# Altium project PV Refridgerator.PrjPCB (part 1 of 2)
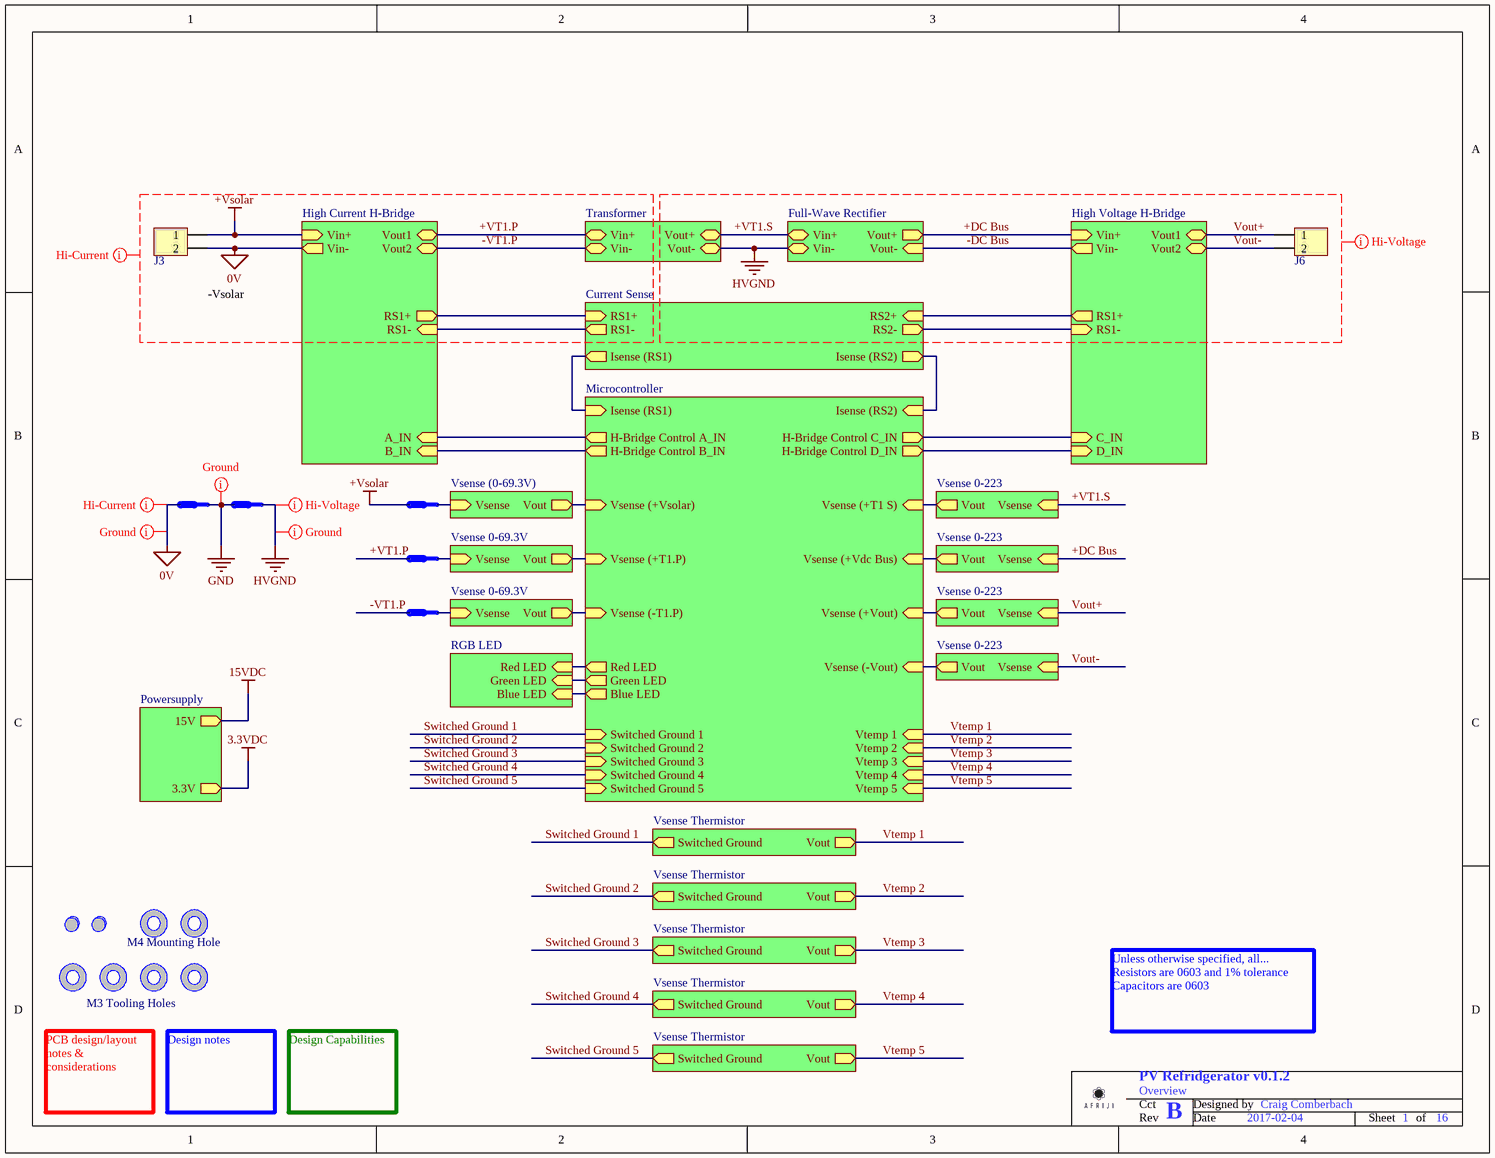
[diagram p0: Overview.SchDoc]
Designer: Craig Comberbach; ProjectRevision: v0.1.2; ProjectTitle: PV Refridgerator
9 sheets, 91 parts. Net scope: hierarchical (ports join the sheet entries above them; power ports are global).
Board file: PV Refridgerator v0.1.2.PCBDOC
Sheets:
  Overview.SchDoc
    High Current H-Bridge = High Current H-Bridge.SchDoc
      Half H-Bridge Driver = Half H-Bridge Driver.SchDoc
      Half H-Bridge Driver = Half H-Bridge Driver.SchDoc
    High Voltage H-Bridge = High Voltage H-Bridge.SchDoc
      Half H-Bridge Driver = Half H-Bridge Driver.SchDoc
      Half H-Bridge Driver = Half H-Bridge Driver.SchDoc
    Transformer = Transformer.SchDoc
    Microcontroller = Microcontroller.SchDoc
    Vsense 0-69.3V = Vsense 0-69.3V.SchDoc
    Vsense 0-223 = Vsense 0-223.3V.SchDoc
    Current Sense = Current Sense.SchDoc
    Vsense (0-69.3V) = Vsense 0-69.3V.SchDoc
    Vsense 0-69.3V = Vsense 0-69.3V.SchDoc
    Vsense 0-223 = Vsense 0-223.3V.SchDoc
    Vsense 0-223 = Vsense 0-223.3V.SchDoc
    Vsense 0-223 = Vsense 0-223.3V.SchDoc

## Sheet Overview.SchDoc: Overview
size Letter; Date: 2017-02-04; DocumentNumber: 1; Revision: B; SheetNumber: 1; SheetTotal: 16; DesignedBy: Craig Comberbach

### Parts
FID1  Fiducial, Double Sided  [Fiducial - Double sided]  (value not drawn)
FID3  Fiducial, Double Sided  [Fiducial - Double sided]  (value not drawn)
J3  Terminal Block - 2-Position HiV/HiA  [TE 796739-2]  (value not drawn)
J6  Terminal Block - 2-Position HiV/HiA  [TE 796739-2]  (value not drawn)
MountingHole1  M3 Tooling Holes  [M3 Screw - One Sided]  (no BOM)
MountingHole2  Mounting Hole  [M3 Screw - One Sided]  (value not drawn)  (no BOM)
MountingHole3  Mounting Hole  [M4 Screw - One Sided]  (value not drawn)  (no BOM)
MountingHole4  M4 Mounting Hole  [M4 Screw - One Sided]  (no BOM)
MountingHole5  Mounting Hole  [M3 Screw - One Sided]  (value not drawn)  (no BOM)
MountingHole6  Mounting Hole  [M3 Screw - One Sided]  (value not drawn)  (no BOM)
NetTie2  Net Tie  [Net tie (7/50 mil)]  (value not drawn)  (net tie, no BOM)
NetTie7  Net Tie  [Net tie (7/7 mil)]  (value not drawn)  (net tie, no BOM)
NetTie8  Net Tie  [Net tie (7/7 mil)]  (value not drawn)  (net tie, no BOM)
NetTie9  Net Tie  [Net tie (7/7 mil)]  (value not drawn)  (net tie, no BOM)
NetTie?  Net Tie  [Net tie (7/7 mil)]  (value not drawn)  (net tie, no BOM)

### Sub-sheets
Current Sense = Current Sense.SchDoc: RS1+ (in), RS1- (out), RS2+ (in), RS2- (out), Isense (RS1) (out), Isense (RS2) (out)
Full-Wave Rectifier = Full-Wave Rectifier.SchDoc (file not in this document): Vin+ (bidir), Vin- (bidir), Vout+ (out), Vout- (in)
High Current H-Bridge = High Current H-Bridge.SchDoc: Vout1 (bidir), Vout2 (bidir), Vin+ (in), Vin- (out), A_IN (in), B_IN (in), RS1+ (out), RS1- (in)
High Voltage H-Bridge = High Voltage H-Bridge.SchDoc: Vout1 (bidir), Vout2 (bidir), Vin+ (in), Vin- (out), C_IN (in), D_IN (in), RS1+ (out), RS1- (in)
Microcontroller = Microcontroller.SchDoc: H-Bridge Control A_IN (out), H-Bridge Control B_IN (out), H-Bridge Control C_IN (out), H-Bridge Control D_IN (out), Red LED (out), Green LED (out), Blue LED (out), Vsense (+T1.P) (in), Vsense (+Vsolar) (in), Vsense (-T1.P) (in), Vsense (+T1 S) (in), Vsense (+Vdc Bus) (in), Vsense (+Vout) (in), Vsense (-Vout) (in), Vtemp 1 (in), Vtemp 2 (in), Vtemp 3 (in), Vtemp 4 (in), Vtemp 5 (in), Isense (RS1) (in), Isense (RS2) (in), Switched Ground 1 (in), Switched Ground 2 (in), Switched Ground 3 (in), Switched Ground 4 (in), Switched Ground 5 (in)
Powersupply = Powersupply.SchDoc (file not in this document): 15V (out), 3.3V (out)
RGB LED = RGB LED.SchDoc (file not in this document): Red LED (in), Green LED (in), Blue LED (in)
Transformer = Transformer.SchDoc: Vin+ (bidir), Vin- (bidir), Vout+ (bidir), Vout- (bidir)
Vsense 0-69.3V = Vsense 0-69.3V.SchDoc: Vsense (in), Vout (out)
Vsense 0-69.3V = Vsense 0-69.3V.SchDoc: Vsense (in), Vout (out)
Vsense 0-223 = Vsense 0-223.3V.SchDoc: Vsense (in), Vout (out)
Vsense 0-223 = Vsense 0-223.3V.SchDoc: Vsense (in), Vout (out)
Vsense 0-223 = Vsense 0-223.3V.SchDoc: Vsense (in), Vout (out)
Vsense 0-223 = Vsense 0-223.3V.SchDoc: Vsense (in), Vout (out)
Vsense (0-69.3V) = Vsense 0-69.3V.SchDoc: Vsense (in), Vout (out)
Vsense Thermistor = Vsense Thermistor.SchDoc (file not in this document): Switched Ground (out), Vout (out)
Vsense Thermistor = Vsense Thermistor.SchDoc (file not in this document): Switched Ground (out), Vout (out)
Vsense Thermistor = Vsense Thermistor.SchDoc (file not in this document): Switched Ground (out), Vout (out)
Vsense Thermistor = Vsense Thermistor.SchDoc (file not in this document): Switched Ground (out), Vout (out)
Vsense Thermistor = Vsense Thermistor.SchDoc (file not in this document): Switched Ground (out), Vout (out)

### Nets
0V: J3.2 NetTie2.2 ; sheet High Current H-Bridge/Vin-, sheet High Current H-Bridge/RS1-, sheet Current Sense/RS1-
+Vsolar: J3.1 NetTie7.2 ; sheet High Current H-Bridge/Vin+
GND: NetTie2.1 NetTie?.2
HVGND: NetTie?.1 ; sheet Full-Wave Rectifier/Vin-, sheet Transformer/Vout-
+DC Bus: sheet Full-Wave Rectifier/Vout+, sheet High Voltage H-Bridge/Vin+, sheet Vsense 0-223/Vsense
+VT1.P: NetTie8.2 ; sheet High Current H-Bridge/Vout1, sheet Transformer/Vin+
+VT1.S: sheet Full-Wave Rectifier/Vin+, sheet Transformer/Vout+, sheet Vsense 0-223/Vsense
-DC Bus: sheet Full-Wave Rectifier/Vout-, sheet High Voltage H-Bridge/Vin-, sheet High Voltage H-Bridge/RS1-, sheet Current Sense/RS2-
-VT1.P: NetTie9.2 ; sheet High Current H-Bridge/Vout2, sheet Transformer/Vin-
Isense (RS1): sheet Microcontroller/Isense (RS1), sheet Current Sense/Isense (RS1)
Isense (RS2): sheet Microcontroller/Isense (RS2), sheet Current Sense/Isense (RS2)
LOA HiA: sheet High Current H-Bridge/A_IN, sheet Microcontroller/H-Bridge Control A_IN
LOA HiV: sheet High Voltage H-Bridge/D_IN, sheet Microcontroller/H-Bridge Control D_IN
LOB HiA: sheet High Current H-Bridge/B_IN, sheet Microcontroller/H-Bridge Control B_IN
LOB HiV: sheet High Voltage H-Bridge/C_IN, sheet Microcontroller/H-Bridge Control C_IN
Switched Ground 1: sheet Microcontroller/Switched Ground 1, sheet Vsense Thermistor/Switched Ground
Switched Ground 2: sheet Microcontroller/Switched Ground 2, sheet Vsense Thermistor/Switched Ground
Switched Ground 3: sheet Microcontroller/Switched Ground 3, sheet Vsense Thermistor/Switched Ground
Switched Ground 4: sheet Microcontroller/Switched Ground 4, sheet Vsense Thermistor/Switched Ground
Switched Ground 5: sheet Microcontroller/Switched Ground 5, sheet Vsense Thermistor/Switched Ground
Vout+: J6.1 ; sheet High Voltage H-Bridge/Vout1, sheet Vsense 0-223/Vsense  [project net C_VS]
Vout-: J6.2 ; sheet High Voltage H-Bridge/Vout2, sheet Vsense 0-223/Vsense  [project net D_VS]
Vsense (+T1 S): sheet Microcontroller/Vsense (+T1 S), sheet Vsense 0-223/Vout
Vsense (+T1.P): sheet Microcontroller/Vsense (+T1.P), sheet Vsense 0-69.3V/Vout
Vsense (+Vdc Bus): sheet Microcontroller/Vsense (+Vdc Bus), sheet Vsense 0-223/Vout
Vsense (+Vout): sheet Microcontroller/Vsense (+Vout), sheet Vsense 0-223/Vout
Vsense (+Vsolar): sheet Microcontroller/Vsense (+Vsolar), sheet Vsense (0-69.3V)/Vout
Vsense (-T1.P): sheet Microcontroller/Vsense (-T1.P), sheet Vsense 0-69.3V/Vout
Vsense (-Vout): sheet Microcontroller/Vsense (-Vout), sheet Vsense 0-223/Vout
Vtemp 1: sheet Microcontroller/Vtemp 1, sheet Vsense Thermistor/Vout
Vtemp 2: sheet Microcontroller/Vtemp 2, sheet Vsense Thermistor/Vout
Vtemp 3: sheet Microcontroller/Vtemp 3, sheet Vsense Thermistor/Vout
Vtemp 4: sheet Microcontroller/Vtemp 4, sheet Vsense Thermistor/Vout
Vtemp 5: sheet Microcontroller/Vtemp 5, sheet Vsense Thermistor/Vout
NetNetTie3_2: sheet High Current H-Bridge/RS1+, sheet Current Sense/RS1+
NetNetTie5_2: sheet High Voltage H-Bridge/RS1+, sheet Current Sense/RS2+
NetNetTie7_1: NetTie7.1 ; sheet Vsense (0-69.3V)/Vsense
NetNetTie8_1: NetTie8.1 ; sheet Vsense 0-69.3V/Vsense
NetNetTie9_1: NetTie9.1 ; sheet Vsense 0-69.3V/Vsense
NetU1_43: sheet Microcontroller/Red LED, sheet RGB LED/Red LED
NetU1_44: sheet Microcontroller/Green LED, sheet RGB LED/Green LED
NetU1_45: sheet Microcontroller/Blue LED, sheet RGB LED/Blue LED

### Layout directives
net class 15A: 0V, +Vsolar, +VT1.P, -VT1.P
net class 171-250V: +DC Bus, +VT1.S, -DC Bus, HVGND, Vout+, Vout-
net class Grounds: 0V, GND, HVGND

### Notes on the sheet
- (near J3) -Vsolar
- Unless otherwise specified, all...
  Resistors are 0603 and 1% tolerance
  Capacitors are 0603
- PCB design/layout notes & considerations
- Design notes
- Design Capabilities
- Cct
- Designed by
- Rev
- Date
- Sheet
- of

### Library data of the parts
J3 J6 = Terminal Block - 2-Position HiV/HiA: Manufacturer: TE Connectivity AMP Connectors; Manufacturer Part Number: 796739-2; Number of Levels: 1; Positions Per Level: 2; Pitch: 0.375" (9.53mm); Mating Orientation: Horizontal with Board; Current: 30A; Voltage: 600V; Wire Gauge: 10-30 AWG; Wire Termination: Screw - Rising Cage Clamp; Clamp Material - Plating: Brass - Nickel Plated; Torque - Screw: 0.79 Nm (7.0 Lb-In); Screw Thread: M3; Supplier 1: Digi-Key; RoHS: RoHS Compliant; Category: Connectors, Interconnects; Stock 1: 14124; Pricing 1: 1=2.21, 10=1.673, 25=1.5504, 50=1.394, 100=1.36, 250=1.19, 500=1.088, 1000=0.986, 2500=0.884 (USD); Packaging: Tray; Part Status: Active; Mounting Type: Through Hole; Features: Interlocking (Side); Color: Green; Operating Temperature: -; Housing Material: Polyamide (PA66), Nylon 6/6; Contact Material - Plating: -; Screw Material - Plating: Brass - Nickel Plated; ComponentLink1URL: http://www.te.com/commerce/DocumentDelivery/DDEController?Action=srchrtrv&DocNm=796739&DocType=Customer+Drawing&DocLang=English; ComponentLink1Description: Spec Sheet; Supplier Part Number 1: A98273-ND
MountingHole1 MountingHole4 = Mounting Hole
NetTie2 NetTie7-NetTie9 NetTie? = Net Tie: Ties two nets together
FID1 FID3 = Fiducial, Double Sided: Technology: Mechanical

## Sheet High Current H-Bridge.SchDoc: High Current H-Bridge
size Letter; Date: 2017-01-26; DocumentNumber: 2; Revision: A; SheetNumber: 2; SheetTotal: 16; DesignedBy: Mike MacKay
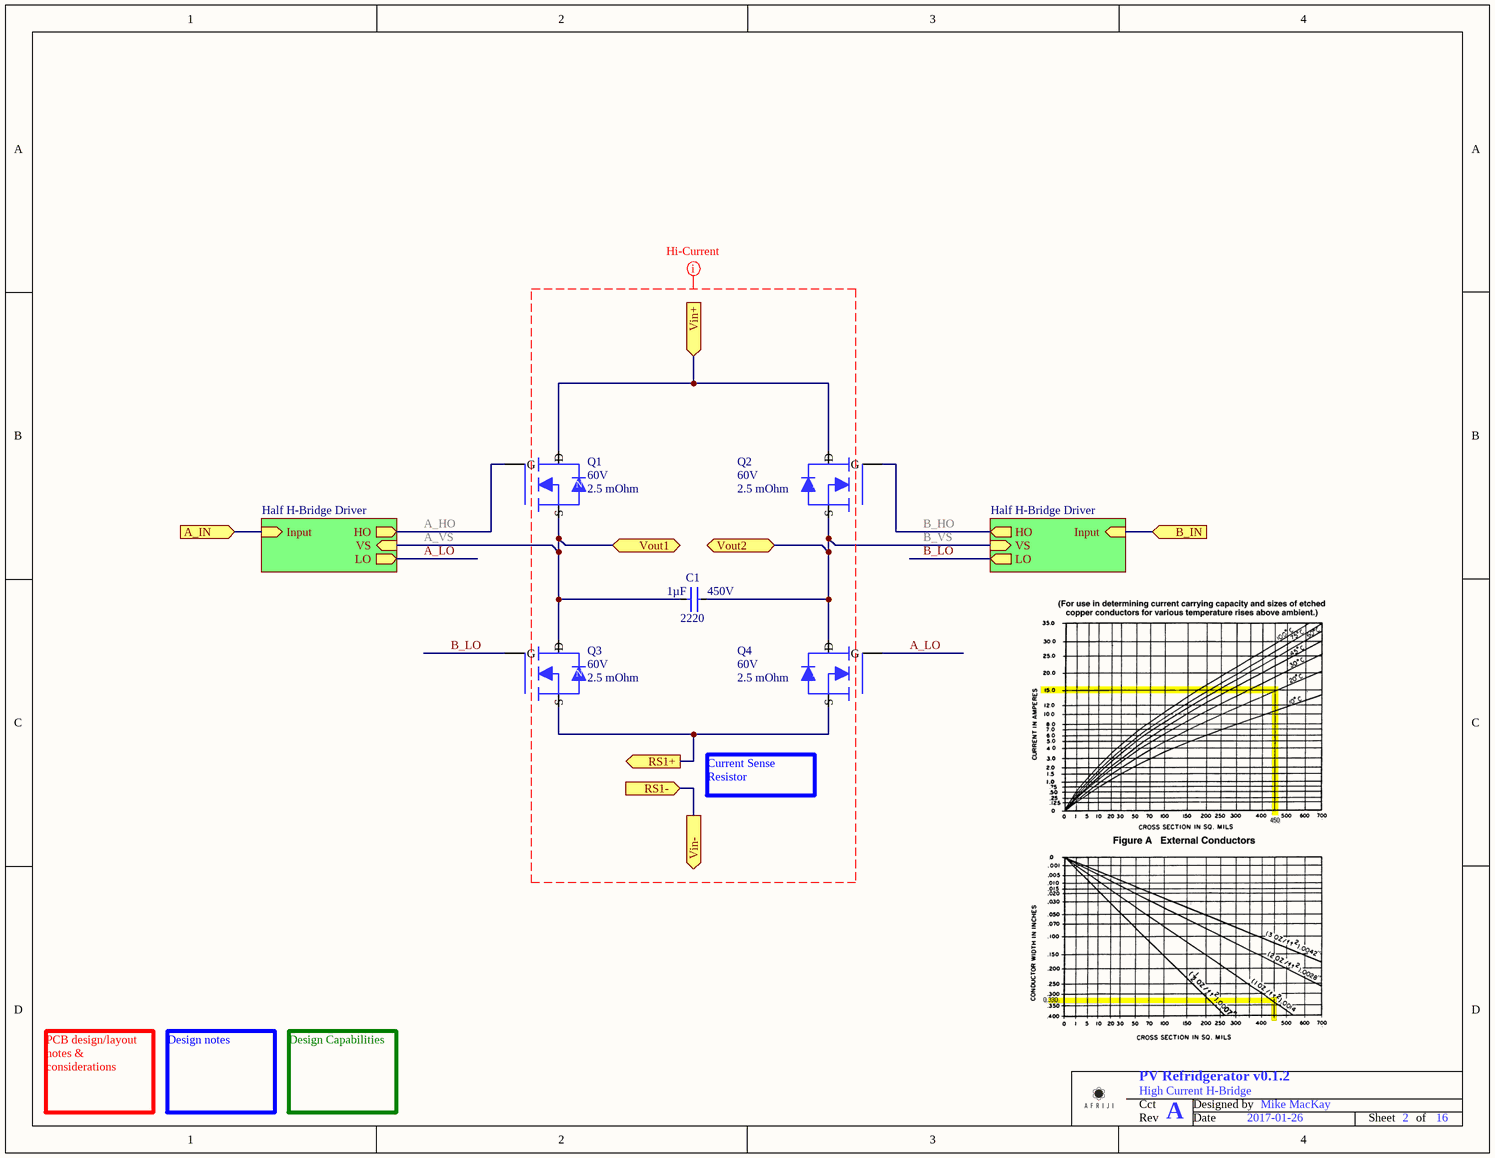
[diagram p1: High Current H-Bridge.SchDoc]

### Parts
C1  Capacitance: 1µF  Voltage - Rated: 450V  Package / Case: 2220  [C2220 - Ceramic]  (hidden comment: 1uF 2220 450V)
Q1  Drain to Source Voltage (Vdss): 60V  Rds On (Max) @ Id, Vgs: 2.5 mOhm  [DPAK]  (hidden comment: N-MOSFET)
Q2  Drain to Source Voltage (Vdss): 60V  Rds On (Max) @ Id, Vgs: 2.5 mOhm  [DPAK]  (hidden comment: N-MOSFET)
Q3  Drain to Source Voltage (Vdss): 60V  Rds On (Max) @ Id, Vgs: 2.5 mOhm  [DPAK]  (hidden comment: N-MOSFET)
Q4  Drain to Source Voltage (Vdss): 60V  Rds On (Max) @ Id, Vgs: 2.5 mOhm  [DPAK]  (hidden comment: N-MOSFET)

### Sub-sheets
Half H-Bridge Driver = Half H-Bridge Driver.SchDoc: HO (out), VS (in), LO (out), Input (in)
Half H-Bridge Driver = Half H-Bridge Driver.SchDoc: HO (out), VS (in), LO (out), Input (in)

### Ports
A_IN (in), B_IN (in), RS1+ (out), RS1- (in), Vin+ (in), Vin- (out), Vout1 (bidir), Vout2 (bidir)

### Nets
0V: port Vin-, port RS1-
+Vsolar: Q1.2(D) Q2.2(D) ; port Vin+
A_HO: Q1.1(G) ; sheet Half H-Bridge Driver/HO
A_LO: Q4.1(G) ; sheet Half H-Bridge Driver/LO
A_VS: C1.1 Q1.3(S) Q3.2(D) ; port Vout1, sheet Half H-Bridge Driver/VS  [project net +VT1.P]
B_HO: Q2.1(G) ; sheet Half H-Bridge Driver/HO
B_LO: Q3.1(G) ; sheet Half H-Bridge Driver/LO
B_VS: C1.2 Q2.3(S) Q4.2(D) ; port Vout2, sheet Half H-Bridge Driver/VS  [project net -VT1.P]
LOA HiA: port A_IN, sheet Half H-Bridge Driver/Input
LOB HiA: port B_IN, sheet Half H-Bridge Driver/Input
NetNetTie3_2: Q3.3(S) Q4.3(S) ; port RS1+

### Layout directives
net class 15A: (no net found under the mark)

### Notes on the sheet
- Current Sense Resistor
- PCB design/layout notes & considerations
- Design notes
- Design Capabilities
- Cct
- Designed by
- Rev
- Date
- Sheet
- of
- (in symbol N-MOSFET 2.5mR 60V) N

### Library data of the parts
C1 = 1uF 2220 450V: Manufacturer: TDK Corporation; Manufacturer Part Number: CGA9P4X7T2W105M250KE; Tolerance: ±20%; Temperature Coefficient: X7T; Supplier 1: Digi-Key; Supplier Part Number 1: 445-7998-1-ND; RoHS: RoHS Compliant; Category: Capacitors; Stock 1: 10247; Pricing 1: 1=3.11, 10=2.576, 100=2.1589, 250=1.78012 (USD); Packaging: Cut Tape (CT); Part Status: Active; Operating Temperature: -55°C ~ 125°C; Features: Soft Termination; Ratings: AEC-Q200; Applications: Automotive, Boardflex Sensitive; Failure Rate: -; Mounting Type: Surface Mount, MLCC; Size / Dimension: 0.224" L x 0.197" W (5.70mm x 5.00mm); Height - Seated (Max): -; Thickness (Max): 0.098" (2.50mm); Lead Spacing: -; Lead Style: -; ComponentLink1URL: https://product.tdk.com/info/en/catalog/datasheets/mlcc_automotive_soft_en.pdf; ComponentLink1Description: Spec Sheet; Value: 1uF 2220 450V
Q1-Q4 = N-MOSFET 2.5mR 60V: Manufacturer: Infineon Technologies; Manufacturer Part Number: IPD025N06N; FET Type: N-Channel; Current - Continuous Drain (Id) @ 25°C: 90A; Drive Voltage (Max Rds On,  Min Rds On): 6V, 10V; Vgs(th) (Max) @ Id: 2.8V @ 95µA; Gate Charge (Qg) (Max) @ Vgs: 71nC @ 10V; Input Capacitance (Ciss) (Max) @ Vds: 5200pF @ 30V; Vgs (Max): ±20V; Power Dissipation (Max): 3W (Ta), 167W (Tc); Supplier 1: Digi-Key; Supplier Part Number 1: IPD025N06NCT-ND; RoHS: RoHS Compliant; Category: Discrete Semiconductor Products; Stock 1: 5405; Pricing 1: 1=1.91, 10=1.72, 100=1.3822, 500=1.13558, 1000=0.94091 (USD); Packaging: Cut Tape (CT); Part Status: Active; Technology: MOSFET (Metal Oxide); FET Feature: -; Operating Temperature: -55°C ~ 175°C (TJ); Mounting Type: Surface Mount; Supplier Device Package: PG-TO252-3; Package / Case: TO-252-3, DPak (2 Leads + Tab), SC-63; ComponentLink1URL: http://www.infineon.com/dgdl/IPD025N06N_Rev2+1.pdf?folderId=db3a304313b8b5a60113cee8763b02d7&fileId=db3a304336415dec0136531648062c76; ComponentLink1Description: Spec Sheet; Value: N-MOSFET 2.5mR

## Sheet Half H-Bridge Driver.SchDoc: N-FET Driver
size Letter; Date: 2017-02-04; DocumentNumber: 3; Revision: A; SheetNumber: 3; SheetTotal: 16; DesignedBy: Mike MacKay
Used 4 times, as channels High Current H-Bridge/Half H-Bridge Driver, High Current H-Bridge/Half H-Bridge Driver, High Voltage H-Bridge/Half H-Bridge Driver, High Voltage H-Bridge/Half H-Bridge Driver. Parts and nets are listed once, with the designators drawn on the sheet.
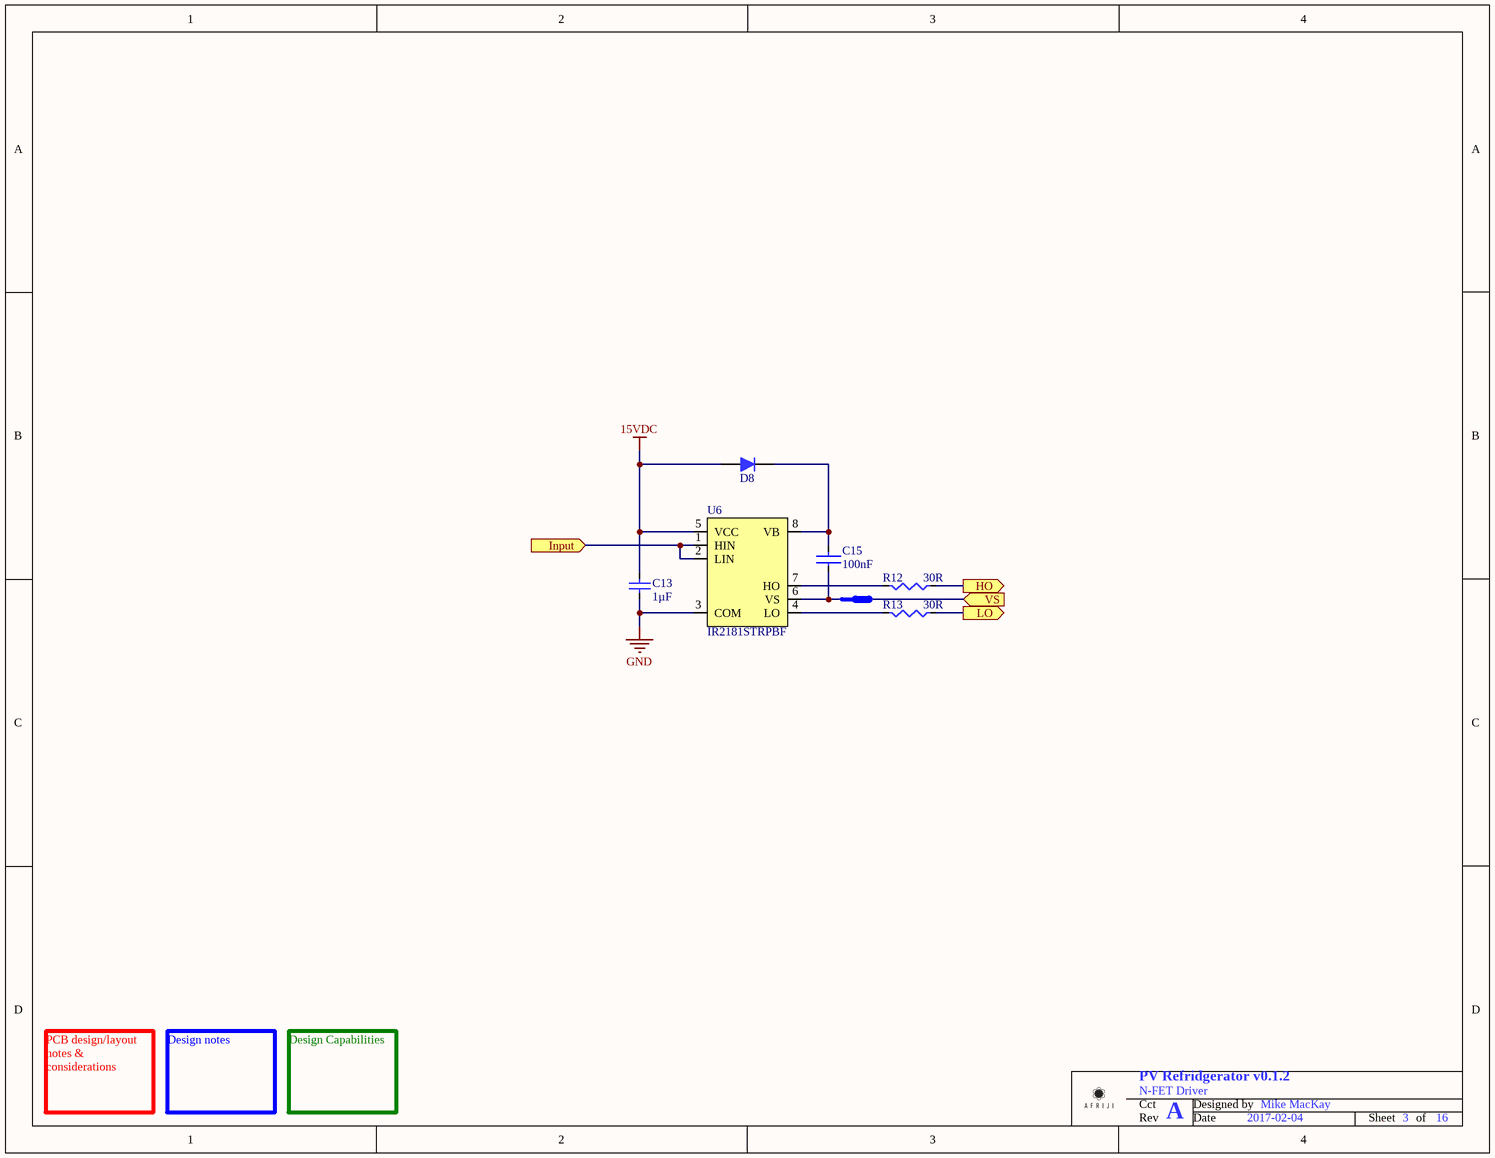
[diagram p2: Half H-Bridge Driver.SchDoc]

### Parts
C13  Capacitance: 1µF  [Capacitor - 0603 Ceramic]  (hidden comment: 1uF 0603 25V)
C15  Capacitance: 100nF  [C0603 - Ceramic]  (hidden comment: 100nF 0603 50V)
D8  (no value)  [SMA - Diode]
NetTie1  Net Tie  [Net tie (7/7 mil)]  (value not drawn)  (net tie, no BOM)
R12  Resistance (Ohms): 30R  [R0603]  (hidden comment: Template - Resistor)
R13  Resistance (Ohms): 30R  [R0603]  (hidden comment: Template - Resistor)
U6  Manufacturer Part Number: IR2181STRPBF  [SOIC-8]  (hidden comment: H-Bridge Driver)

### Ports
HO (out), Input (in), LO (out), VS (in)

### Nets
15VDC: C13.1 D8.1(Anode) U6.5(VCC)
GND: C13.2 U6.3(COM)
HO: R12.2 ; port HO
Input: U6.1(HIN) U6.2(LIN) ; port Input
LO: R13.2 ; port LO
VS: NetTie1.2 ; port VS
NetC15_1: C15.1 D8.2(Cathode) U6.8(VB)
NetC15_2: C15.2 NetTie1.1 U6.6(VS)
NetR12_1: R12.1 U6.7(HO)
NetR13_1: R13.1 U6.4(LO)

### Channels
High Current H-Bridge/Half H-Bridge Driver: designators end in A; ports HO=A_HO Input=LOA HiA LO=A_LO VS=+VT1.P
High Current H-Bridge/Half H-Bridge Driver: designators end in B; ports HO=B_HO Input=LOB HiA LO=B_LO VS=-VT1.P
High Voltage H-Bridge/Half H-Bridge Driver: designators end in C; ports HO=C_HO Input=LOB HiV LO=C_LO VS=C_VS
High Voltage H-Bridge/Half H-Bridge Driver: designators end in D; ports HO=D_HO Input=LOA HiV LO=D_LO VS=D_VS

### Notes on the sheet
- PCB design/layout notes & considerations
- Design notes
- Design Capabilities
- Cct
- Designed by
- Rev
- Date
- Sheet
- of

### Library data of the parts
C13 = 1uF 0603 25V: Non-polarized; Manufacturer: Murata Electronics North America; Manufacturer Part Number: GRM188R61E105KA12D; Value: 1uF 0603 16V; Tolerance: ±10%; Temperature Coefficient: X5R; Technology: SMT; Supplier 1: Digi-Key; RoHS: RoHS Compliant; Category: Capacitors; Stock 1: 1582906; Pricing 1: 1=0.14, 10=0.059, 50=0.0322, 100=0.0273, 250=0.02232, 500=0.01908, 1000=0.01488 (CAD); Packaging: Cut Tape (CT); Voltage - Rated: 25V; Mounting Type: Surface Mount, MLCC; Operating Temperature: -55°C ~ 85°C; Applications: General Purpose; Ratings: -; Package / Case: 0603 (1608 Metric); Size / Dimension: 0.063" L x 0.031" W (1.60mm x 0.80mm); Height - Seated (Max): -; Thickness (Max): 0.035" (0.90mm); Lead Spacing: -; Features: -; Lead Style: -; ComponentLink1URL: http://www.murata.com/~/media/webrenewal/support/library/catalog/products/capacitor/mlcc/c02e.ashx; ComponentLink1Description: Spec Sheet; Supplier Part Number 1: 490-3897-1-ND
C15 = 100nF 0603 50V: Manufacturer: Samsung Electro-Mechanics America, Inc; Manufacturer Part Number: CL10B104KB8SFNC; Tolerance: ±10%; Temperature Coefficient: X7R; Value: 100nF 0603 50V; Supplier 1: Digi-Key; RoHS: RoHS Compliant; Category: Capacitors; Stock 1: 1192070; Pricing 1: 1=0.1, 10=0.027, 25=0.0192, 100=0.0125, 500=0.00874, 1000=0.00681 (USD); Packaging: Cut Tape (CT); Voltage - Rated: 50V; Mounting Type: Surface Mount, MLCC; Operating Temperature: -55°C ~ 125°C; Applications: Boardflex Sensitive; Ratings: -; Package / Case: 0603 (1608 Metric); Size / Dimension: 0.063" L x 0.031" W (1.60mm x 0.80mm); Height - Seated (Max): -; Thickness (Max): 0.035" (0.90mm); Lead Spacing: -; Features: Soft Termination; Lead Style: -; ComponentLink1URL: http://www.samsungsem.com/kr/front/downloadcms.do?path=/kr/support/product-search/mlcc/__icsFiles/afieldfile/2014/11/05&fileName=S_CL10B104KB8SFNC.pdf; ComponentLink1Description: http://www.samsungsem.com/kr/front/downloadcms.do?path=/kr/support/product-search/mlcc/__icsFiles/afieldfile/2014/11/05&fileName=S_CL10B104KB8SFNC.pdf; Supplier Part Number 1: 1276-1936-1-ND
D8 = Diode - Signal 1A: Signal Diode; Manufacturer: Vishay Semiconductor Diodes Division; Manufacturer Part Number: US1G-E3/5AT; Diode Type: Standard; Voltage - DC Reverse (Vr) (Max): 400V; Current - Average Rectified (Io): 1A; Voltage - Forward (Vf) (Max) @ If: 1V @ 1A; Speed: Fast Recovery =< 500ns, > 200mA (Io); Reverse Recovery Time (trr): 50ns; Current - Reverse Leakage @ Vr: 10µA @ 400V; Capacitance @ Vr, F: 15pF @ 4V, 1MHz; Supplier 1: Digi-Key; Supplier Part Number 1: US1G-E3/5ATGICT-ND; RoHS: RoHS Compliant; Category: Discrete Semiconductor Products; Stock 1: 29002; Pricing 1: 1=0.41, 10=0.312, 25=0.2816, 100=0.1945, 250=0.1638, 500=0.1331, 1000=0.10238, 2500=0.09214 (USD); Packaging: Cut Tape (CT); Part Status: Active; Mounting Type: Surface Mount; Package / Case: DO-214AC, SMA; Supplier Device Package: DO-214AC (SMA); Operating Temperature - Junction: -55°C ~ 150°C; ComponentLink1URL: http://www.vishay.com/docs/88768/us1.pdf; ComponentLink1Description: Spec Sheet
NetTie1 = Net Tie: Ties two nets together
R12 R13 = Template - Resistor: Manufacturer: Yageo; Manufacturer Part Number: RC0603FR-0730RL; Tolerance: ±1%; Power (Watts): 0.1W, 1/10W; Temperature Coefficient: ±100ppm/°C; Supplier 1: Digi-Key; Supplier Part Number 1: 311-30.0HRCT-ND; RoHS: RoHS Compliant; Category: Resistors; Stock 1: 158658; Pricing 1: 1=0.1, 10=0.013, 25=0.0092, 50=0.007, 100=0.0052, 250=0.00396, 500=0.00316, 1000=0.00233 (USD); Packaging: Cut Tape (CT); Part Status: Active; Composition: Thick Film; Features: Moisture Resistant; Operating Temperature: -55°C ~ 155°C; Package / Case: 0603 (1608 Metric); Supplier Device Package: 0603; Size / Dimension: 0.063" L x 0.031" W (1.60mm x 0.80mm); Height - Seated (Max): 0.022" (0.55mm); Number of Terminations: 2; Failure Rate: -; ComponentLink1URL: http://www.yageo.com/NewPortal/yageodocoutput?fileName=/pdf/R-Chip/PYu-RC_Group_51_RoHS_L_4.pdf; ComponentLink1Description: Spec Sheet
U6 = H-Bridge Driver: Manufacturer: Infineon Technologies; Driven Configuration: Half-Bridge; Channel Type: Independent; Gate Type: IGBT, N-Channel MOSFET; Voltage - Supply: 10 V ~ 20 V; Logic Voltage - VIL, VIH: 0.8V, 2.7V; Current - Peak Output (Source, Sink): 1.9A, 2.3A; Input Type: Non-Inverting; High Side Voltage - Max (Bootstrap): 600V; Rise / Fall Time (Typ): 40ns, 20ns; Supplier 1: Digi-Key; RoHS: RoHS Compliant; Category: Integrated Circuits (ICs); Stock 1: 2915; Pricing 1: 1=3.06, 10=2.75, 100=2.2535, 500=1.9184, 1000=1.61792 (USD); Packaging: Cut Tape (CT); Part Status: Active; Operating Temperature: -40°C ~ 150°C (TJ); Mounting Type: Surface Mount; Package / Case: 8-SOIC (0.154", 3.90mm Width); Supplier Device Package: 8-SOIC; ComponentLink1URL: http://www.irf.com/product-info/datasheets/data/ir2181.pdf; ComponentLink1Description: Spec Sheet; Supplier Part Number 1: IR2181SPBFCT-ND

## Sheet High Voltage H-Bridge.SchDoc: High Voltage H-Bridge
size Letter; Date: 2017-01-26; DocumentNumber: 7; Revision: A; SheetNumber: 7; SheetTotal: 16; DesignedBy: Mike MacKay
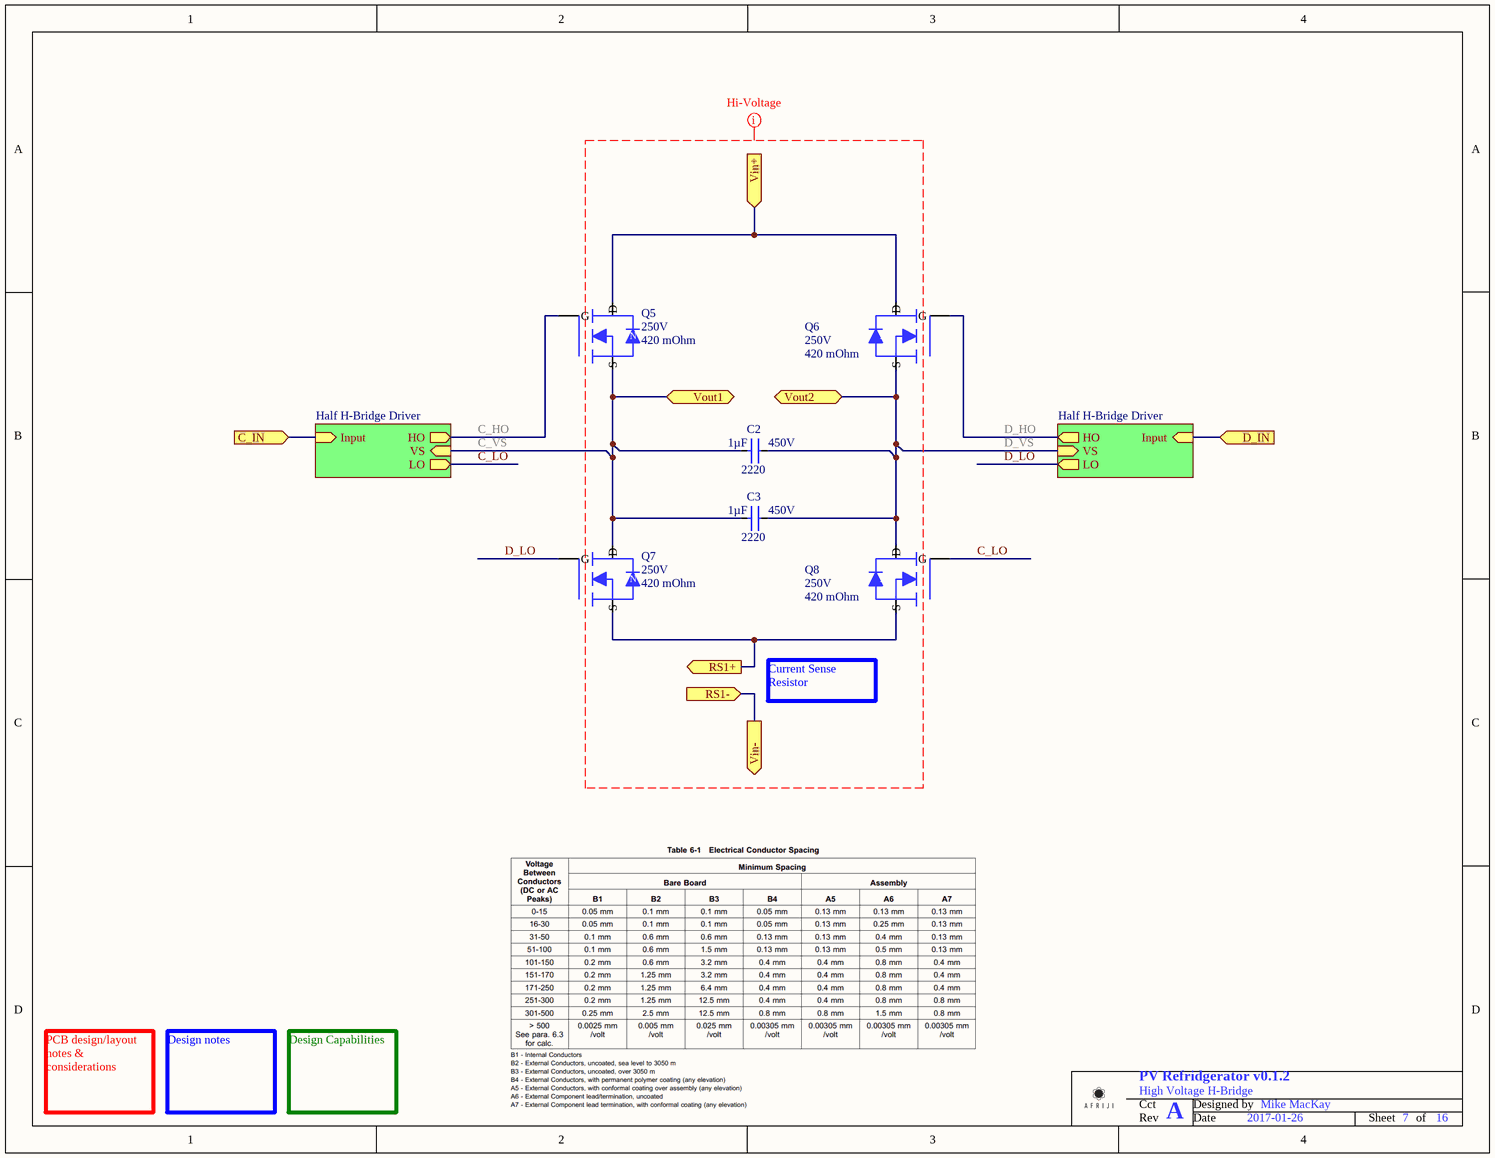
[diagram p3: High Voltage H-Bridge.SchDoc]

### Parts
C2  Capacitance: 1µF  Voltage - Rated: 450V  Package / Case: 2220  [C2220 - Ceramic]  (hidden comment: 1uF 2220 450V)
C3  Capacitance: 1µF  Voltage - Rated: 450V  Package / Case: 2220  [C2220 - Ceramic]  (hidden comment: 1uF 2220 450V)
Q5  Drain to Source Voltage (Vdss): 250V  Rds On (Max) @ Id, Vgs: 420 mOhm  [DPAK]  (hidden comment: N-MOSFET 420mR 250V)
Q6  Drain to Source Voltage (Vdss): 250V  Rds On (Max) @ Id, Vgs: 420 mOhm  [DPAK]  (hidden comment: N-MOSFET 420mR 250V)
Q7  Drain to Source Voltage (Vdss): 250V  Rds On (Max) @ Id, Vgs: 420 mOhm  [DPAK]  (hidden comment: N-MOSFET 420mR 250V)
Q8  Drain to Source Voltage (Vdss): 250V  Rds On (Max) @ Id, Vgs: 420 mOhm  [DPAK]  (hidden comment: N-MOSFET 420mR 250V)

### Sub-sheets
Half H-Bridge Driver = Half H-Bridge Driver.SchDoc: HO (out), VS (in), LO (out), Input (in)
Half H-Bridge Driver = Half H-Bridge Driver.SchDoc: HO (out), VS (in), LO (out), Input (in)

### Ports
C_IN (in), D_IN (in), RS1+ (out), RS1- (in), Vin+ (in), Vin- (out), Vout1 (bidir), Vout2 (bidir)

### Nets
+DC Bus: Q5.2(D) Q6.2(D) ; port Vin+
-DC Bus: port Vin-, port RS1-
C_HO: Q5.1(G) ; sheet Half H-Bridge Driver/HO
C_LO: Q8.1(G) ; sheet Half H-Bridge Driver/LO
C_VS: C2.1 C3.1 Q5.3(S) Q7.2(D) ; port Vout1, sheet Half H-Bridge Driver/VS
D_HO: Q6.1(G) ; sheet Half H-Bridge Driver/HO
D_LO: Q7.1(G) ; sheet Half H-Bridge Driver/LO
D_VS: C2.2 C3.2 Q6.3(S) Q8.2(D) ; port Vout2, sheet Half H-Bridge Driver/VS
LOA HiV: port D_IN, sheet Half H-Bridge Driver/Input
LOB HiV: port C_IN, sheet Half H-Bridge Driver/Input
NetNetTie5_2: Q7.3(S) Q8.3(S) ; port RS1+

### Layout directives
net class 171-250V: (no net found under the mark)

### Notes on the sheet
- Current Sense Resistor
- PCB design/layout notes & considerations
- Design notes
- Design Capabilities
- Cct
- Designed by
- Rev
- Date
- Sheet
- of
- (in symbol N-MOSFET 420mR 250V) N

### Library data of the parts
C2 C3 = 1uF 2220 450V: as C1 on sheet High Current H-Bridge; Supplier 1: Digi-Key; Supplier Part Number 1: 445-7998-1-ND; RoHS: RoHS Compliant; Category: Capacitors; Stock 1: 10247; Pricing 1: 1=3.11, 10=2.576, 100=2.1589, 250=1.78012 (USD); Packaging: Cut Tape (CT); Part Status: Active; Operating Temperature: -55°C ~ 125°C; Features: Soft Termination; Ratings: AEC-Q200; Applications: Automotive, Boardflex Sensitive; Failure Rate: -; Mounting Type: Surface Mount, MLCC; Size / Dimension: 0.224" L x 0.197" W (5.70mm x 5.00mm); Height - Seated (Max): -; Thickness (Max): 0.098" (2.50mm); Lead Spacing: -; Lead Style: -; ComponentLink1URL: https://product.tdk.com/info/en/catalog/datasheets/mlcc_automotive_soft_en.pdf; ComponentLink1Description: Spec Sheet; Value: 1uF 2220 450V
Q5-Q8 = N-MOSFET 420mR 250V: Manufacturer: Fairchild/ON Semiconductor; Manufacturer Part Number: FQD9N25TM; FET Type: N-Channel; Current - Continuous Drain (Id) @ 25°C: 7.4A (Tc); Drive Voltage (Max Rds On,  Min Rds On): 10V; Vgs(th) (Max) @ Id: 5V @ 250µA; Gate Charge (Qg) (Max) @ Vgs: 20nC @ 10V; Input Capacitance (Ciss) (Max) @ Vds: 700pF @ 25V; Vgs (Max): ±30V; Power Dissipation (Max): 2.5W (Ta), 55W (Tc); Supplier 1: Digi-Key; Supplier Part Number 1: FQD9N25TMCT-ND; RoHS: RoHS Compliant; Category: Discrete Semiconductor Products; Stock 1: 4941; Pricing 1: 1=0.86, 10=0.766, 100=0.597, 500=0.49316, 1000=0.38934 (USD); Packaging: Cut Tape (CT); Part Status: Active; Technology: MOSFET (Metal Oxide); FET Feature: -; Operating Temperature: -55°C ~ 150°C (TJ); Mounting Type: Surface Mount; Supplier Device Package: D-Pak; Package / Case: TO-252-3, DPak (2 Leads + Tab), SC-63; ComponentLink1URL: https://www.fairchildsemi.com/datasheets/FQ/FQD9N25.pdf; ComponentLink1Description: Spec Sheet

## Sheet Transformer.SchDoc: Transformer
size Letter; Date: 2017-01-26; DocumentNumber: 5; Revision: A; SheetNumber: 5; SheetTotal: 16; DesignedBy: Mike MacKay
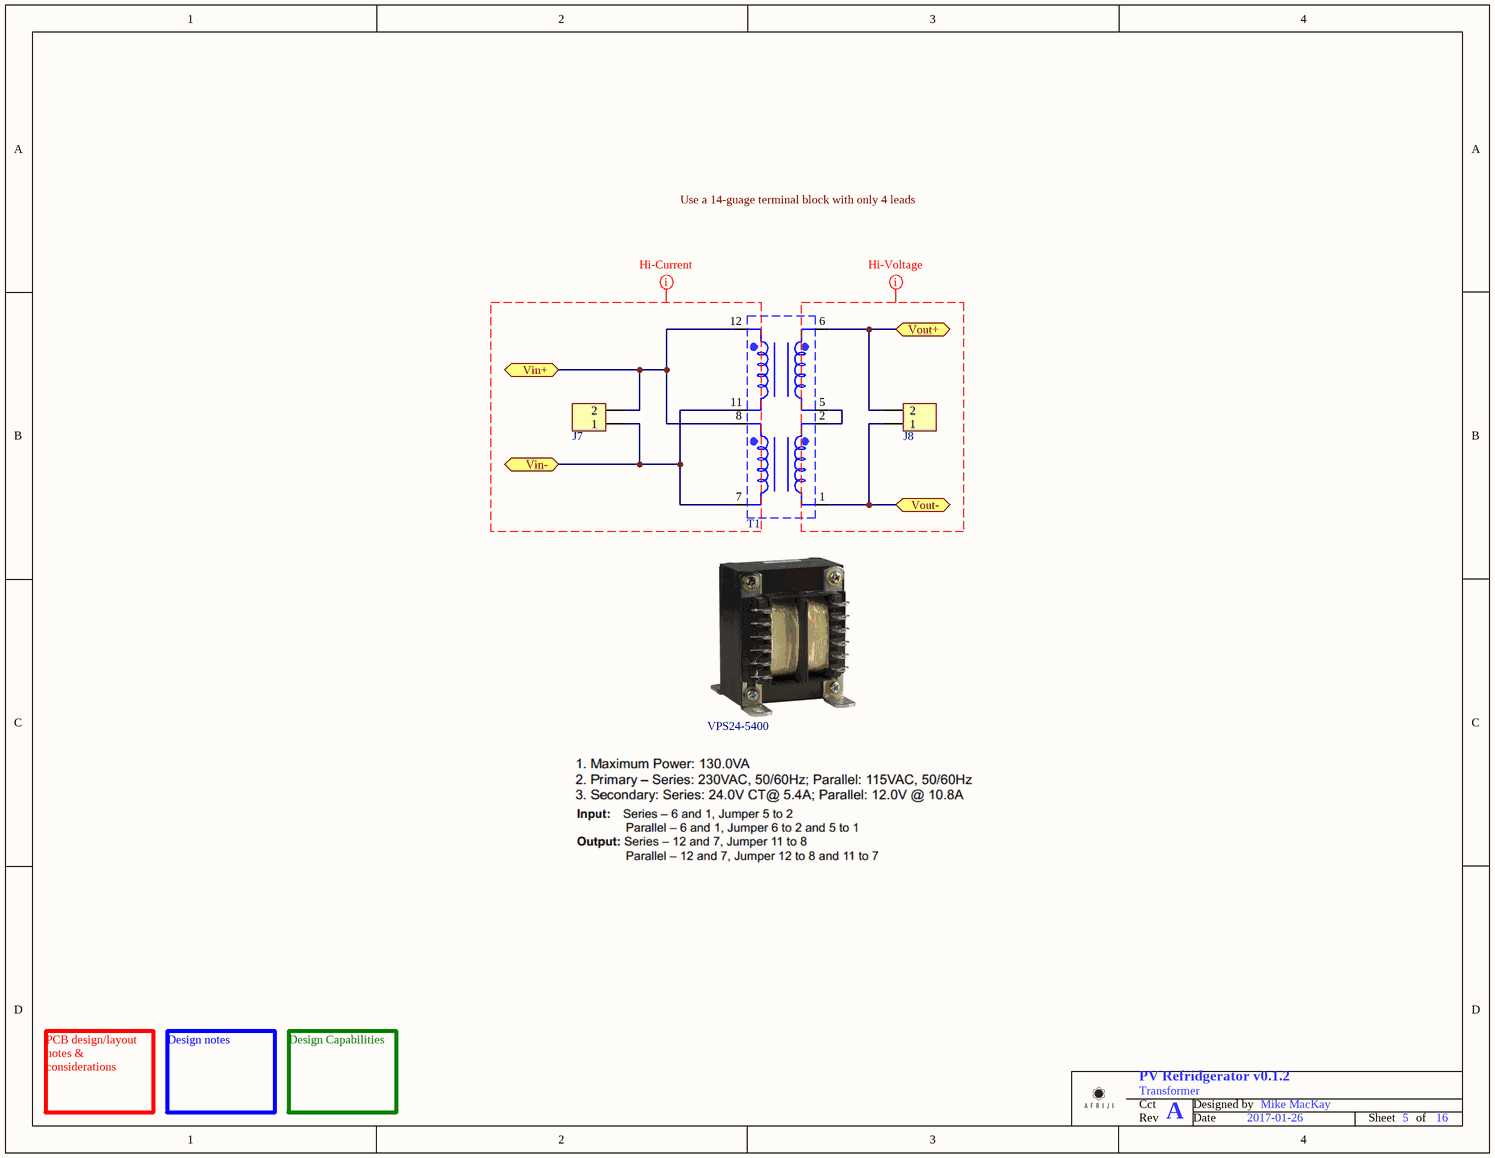
[diagram p4: Transformer.SchDoc]

### Parts
J7  Terminal Block - 2-Position HiV/HiA  [TE 796739-2]  (value not drawn)
J8  Terminal Block - 2-Position HiV/HiA  [TE 796739-2]  (value not drawn)
T1  Transformer Connector  (value not drawn)  (graphical)
Transformer1  Manufacturer Part Number: VPS24-5400  [Transformer]  (hidden comment: Transformer)

### Ports
Vin+ (bidir), Vin- (bidir), Vout+ (bidir), Vout- (bidir)

### Nets
HVGND: J8.1 T1.1 ; port Vout-
+VT1.P: J7.2 T1.8 T1.12 ; port Vin+
+VT1.S: J8.2 T1.6 ; port Vout+
-VT1.P: J7.1 T1.7 T1.11 ; port Vin-
NetT1_2: T1.2 T1.5

### Layout directives
net class 171-250V: (no net found under the mark)
net class 15A: (no net found under the mark)

### Notes on the sheet
- PCB design/layout notes & considerations
- Design notes
- Design Capabilities
- Cct
- Designed by
- Rev
- Date
- Sheet
- of
- Labels drawn without touching a wire or pin: Use a 14-guage terminal block with only 4 leads

### Library data of the parts
J7 J8 = Terminal Block - 2-Position HiV/HiA: as J3 on sheet Overview; Supplier 1: Digi-Key; RoHS: RoHS Compliant; Category: Connectors, Interconnects; Stock 1: 14124; Pricing 1: 1=2.21, 10=1.673, 25=1.5504, 50=1.394, 100=1.36, 250=1.19, 500=1.088, 1000=0.986, 2500=0.884 (USD); Packaging: Tray; Part Status: Active; Mounting Type: Through Hole; Features: Interlocking (Side); Color: Green; Operating Temperature: -; Housing Material: Polyamide (PA66), Nylon 6/6; Contact Material - Plating: -; Screw Material - Plating: Brass - Nickel Plated; ComponentLink1URL: http://www.te.com/commerce/DocumentDelivery/DDEController?Action=srchrtrv&DocNm=796739&DocType=Customer+Drawing&DocLang=English; ComponentLink1Description: Spec Sheet; Supplier Part Number 1: A98273-ND
Transformer1 = Transformer: Manufacturer: Triad Magnetics; Voltage - Primary: 115V, 230V; Voltage - Secondary (Full Load): Parallel 12V, Series 24V; Current - Output (Max): Parallel 10.8A, Series 5.4A; Primary Winding(s): Dual; Center Tap: No; Power - Max: 130 VA; Voltage - Isolation: 4000Vrms; Supplier 1: Digi-Key; RoHS: RoHS Compliant; Category: Transformers; Stock 1: 223; Pricing 1: 1=27.01, 10=23.831, 25=23.0364, 50=20.6534, 100=19.8591 (USD); Part Status: Active; Type: Laminated Core; Secondary Winding(s): Dual; Mounting Type: Chassis Mount; Termination Style: Solder, Quick Connect; Size / Dimension: 60.45mm L x 68.33mm W; Height - Seated (Max): 85.85mm; ComponentLink1URL: http://catalog.triadmagnetics.com/Asset/VPS24-5400.pdf; ComponentLink1Description: Spec Sheet; Supplier Part Number 1: 237-1277-ND

## Sheet Microcontroller.SchDoc: Microcontroller
size Letter; Date: 2017-02-04; DocumentNumber: 10; Revision: A; SheetNumber: 10; SheetTotal: 16; DesignedBy: Craig Comberbach
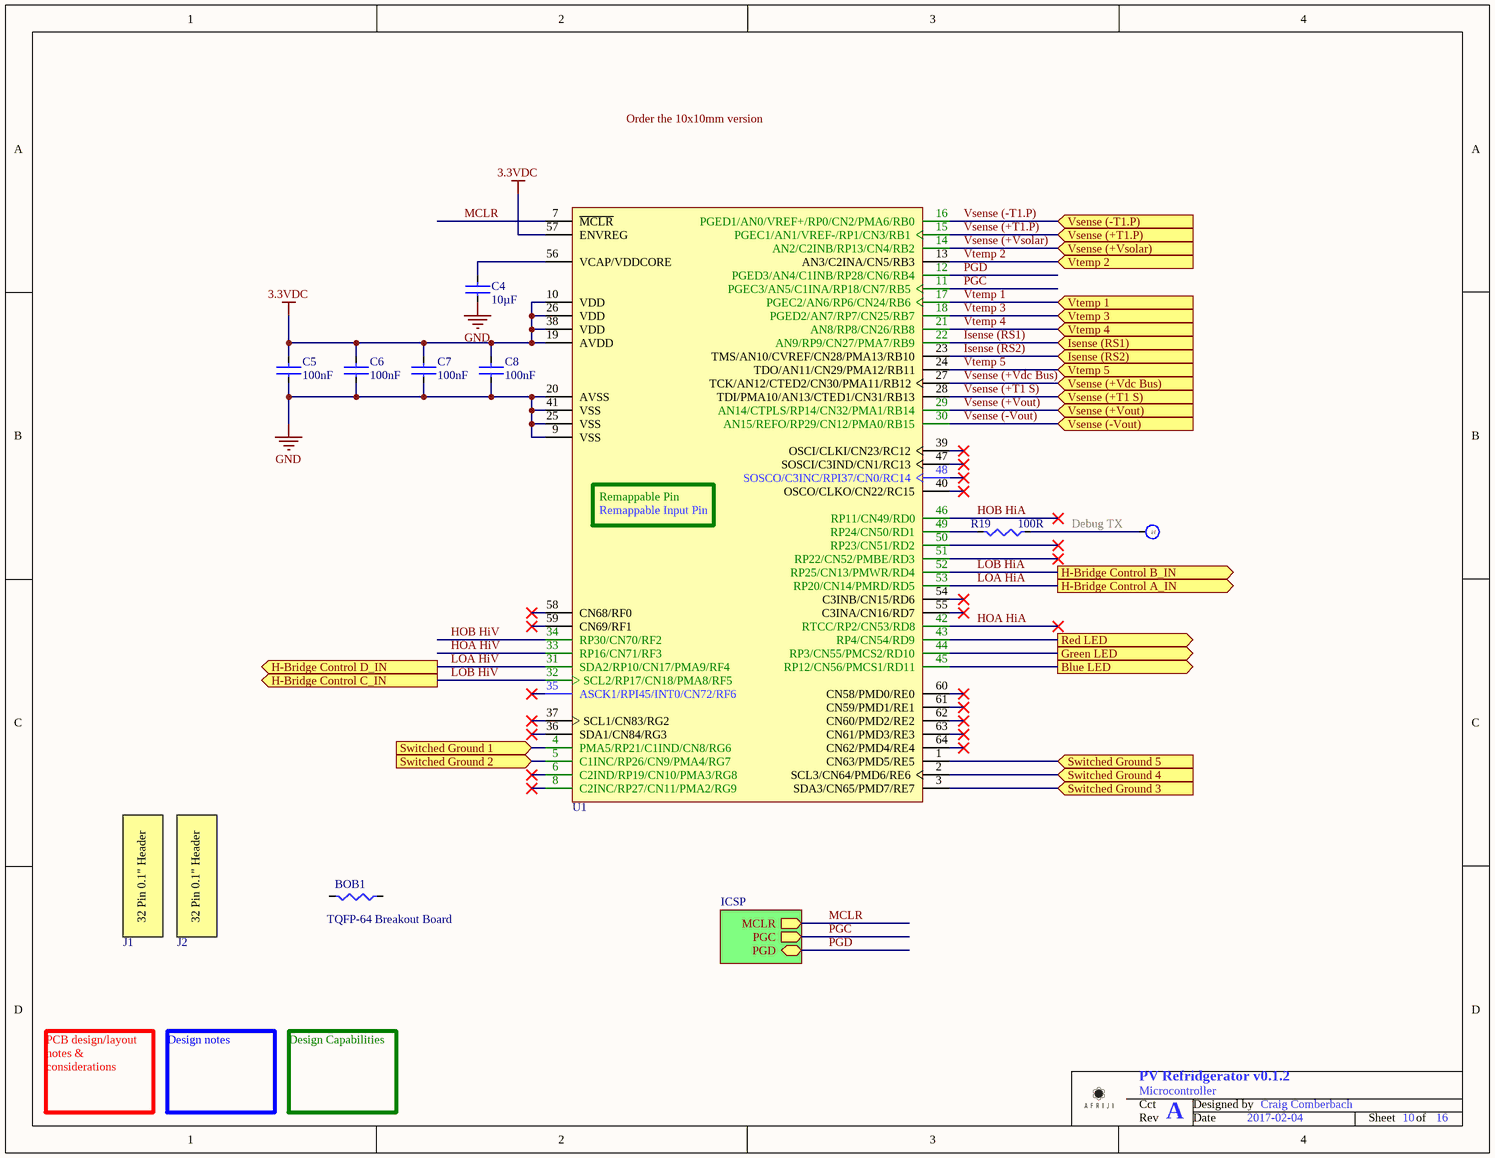
[diagram p5: Microcontroller.SchDoc]

### Parts
BOB1  value TQFP-64 Breakout Board  (hidden comment: 1k 1210 1%)  (mechanical)
C4  Capacitance: 10µF  [C0805 - Ceramic]  (hidden comment: 10uF 0805 10V)
C5  Capacitance: 100nF  [C0603 - Ceramic]  (hidden comment: 100nF 0603 50V)
C6  Capacitance: 100nF  [C0603 - Ceramic]  (hidden comment: 100nF 0603 50V)
C7  Capacitance: 100nF  [C0603 - Ceramic]  (hidden comment: 100nF 0603 50V)
C8  Capacitance: 100nF  [C0603 - Ceramic]  (hidden comment: 100nF 0603 50V)
J1  32-Pin 0.1" Header  (value not drawn)  (mechanical)
J2  32-Pin 0.1" Header  (value not drawn)  (mechanical)
R19  Resistance (Ohms): 100R  [R0603]  (hidden comment: 100R 0603 1%)
TP3  Test Clip  [SMT Test Clip]  (value not drawn)
U1  PIC24FJ256GA106 Microprocessor  [TQFP-64 0.5mm Breakout Board]  (value not drawn)

### Sub-sheets
ICSP = ICSP.SchDoc (file not in this document): MCLR (out), PGD (bidir), PGC (out)

### Ports
Blue LED (out), Green LED (out), H-Bridge Control A_IN (out), H-Bridge Control B_IN (out), H-Bridge Control C_IN (out), H-Bridge Control D_IN (out), Isense (RS1) (in), Isense (RS2) (in), Red LED (out), Switched Ground 1 (in), Switched Ground 2 (in), Switched Ground 3 (in), Switched Ground 4 (in), Switched Ground 5 (in), Vsense (+T1 S) (in), Vsense (+T1.P) (in), Vsense (+Vdc Bus) (in), Vsense (+Vout) (in), Vsense (+Vsolar) (in), Vsense (-T1.P) (in), Vsense (-Vout) (in), Vtemp 1 (in), Vtemp 2 (in), Vtemp 3 (in), Vtemp 4 (in), Vtemp 5 (in)

### Nets
3.3VDC: C5.1 C6.1 C7.1 C8.1 U1.10(VDD) U1.19(AVDD) U1.26(VDD) U1.38(VDD) U1.57(ENVREG)
GND: C4.2 C5.2 C6.2 C7.2 C8.2 U1.9(VSS) U1.20(AVSS) U1.25(VSS) U1.41(VSS)
Debug TX: R19.2 TP3.1
HOA HiA: U1.42(RTCC/RP2/CN53/RD8)
HOA HiV: U1.33(RP16/CN71/RF3)
HOB HiA: U1.46(RP11/CN49/RD0)
HOB HiV: U1.34(RP30/CN70/RF2)
Isense (RS1): U1.22(AN9/RP9/CN27/PMA7/RB9) ; port Isense (RS1)
Isense (RS2): U1.23(TMS/AN10/CVREF/CN28/PMA13/RB10) ; port Isense (RS2)
LOA HiA: U1.53(RP20/CN14/PMRD/RD5) ; port H-Bridge Control A_IN
LOA HiV: U1.31(SDA2/RP10/CN17/PMA9/RF4) ; port H-Bridge Control D_IN
LOB HiA: U1.52(RP25/CN13/PMWR/RD4) ; port H-Bridge Control B_IN
LOB HiV: U1.32(SCL2/RP17/CN18/PMA8/RF5) ; port H-Bridge Control C_IN
MCLR: U1.7(~{MCLR}) ; sheet ICSP/MCLR
PGC: U1.11(PGEC3/AN5/C1INA/RP18/CN7/RB5) ; sheet ICSP/PGC
PGD: U1.12(PGED3/AN4/C1INB/RP28/CN6/RB4) ; sheet ICSP/PGD
Switched Ground 1: U1.4(PMA5/RP21/C1IND/CN8/RG6) ; port Switched Ground 1
Switched Ground 2: U1.5(C1INC/RP26/CN9/PMA4/RG7) ; port Switched Ground 2
Switched Ground 3: U1.3(SDA3/CN65/PMD7/RE7) ; port Switched Ground 3
Switched Ground 4: U1.2(SCL3/CN64/PMD6/RE6) ; port Switched Ground 4
Switched Ground 5: U1.1(CN63/PMD5/RE5) ; port Switched Ground 5
Vsense (+T1 S): U1.28(TDI/PMA10/AN13/CTED1/CN31/RB13) ; port Vsense (+T1 S)
Vsense (+T1.P): U1.15(PGEC1/AN1/VREF-/RP1/CN3/RB1) ; port Vsense (+T1.P)
Vsense (+Vdc Bus): U1.27(TCK/AN12/CTED2/CN30/PMA11/RB12) ; port Vsense (+Vdc Bus)
Vsense (+Vout): U1.29(AN14/CTPLS/RP14/CN32/PMA1/RB14) ; port Vsense (+Vout)
Vsense (+Vsolar): U1.14(AN2/C2INB/RP13/CN4/RB2) ; port Vsense (+Vsolar)
Vsense (-T1.P): U1.16(PGED1/AN0/VREF+/RP0/CN2/PMA6/RB0) ; port Vsense (-T1.P)
Vsense (-Vout): U1.30(AN15/REFO/RP29/CN12/PMA0/RB15) ; port Vsense (-Vout)
Vtemp 1: U1.17(PGEC2/AN6/RP6/CN24/RB6) ; port Vtemp 1
Vtemp 2: U1.13(AN3/C2INA/CN5/RB3) ; port Vtemp 2
Vtemp 3: U1.18(PGED2/AN7/RP7/CN25/RB7) ; port Vtemp 3
Vtemp 4: U1.21(AN8/RP8/CN26/RB8) ; port Vtemp 4
Vtemp 5: U1.24(TDO/AN11/CN29/PMA12/RB11) ; port Vtemp 5
NetC4_1: C4.1 U1.56(VCAP/VDDCORE)
NetR19_1: R19.1 U1.49(RP24/CN50/RD1)
NetU1_43: U1.43(RP4/CN54/RD9) ; port Red LED
NetU1_44: U1.44(RP3/CN55/PMCS2/RD10) ; port Green LED
NetU1_45: U1.45(RP12/CN56/PMCS1/RD11) ; port Blue LED

Not connected (* = marked no-connect by the designer): BOB1 1 2; U1 6(C2IND/RP19/CN10/PMA3/RG8)* 8(C2INC/RP27/CN11/PMA2/RG9)* 35(ASCK1/RPI45/INT0/CN72/RF6)* 36(SDA1/CN84/RG3)* 37(SCL1/CN83/RG2)* 39(OSCI/CLKI/CN23/RC12)* 40(OSCO/CLKO/CN22/RC15)* 47(SOSCI/C3IND/CN1/RC13)* 48(SOSCO/C3INC/RPI37/CN0/RC14)* 50(RP23/CN51/RD2)* 51(RP22/CN52/PMBE/RD3)* 54(C3INB/CN15/RD6)* 55(C3INA/CN16/RD7)* 58(CN68/RF0)* 59(CN69/RF1)* 60(CN58/PMD0/RE0)* 61(CN59/PMD1/RE1)* 62(CN60/PMD2/RE2)* 63(CN61/PMD3/RE3)* 64(CN62/PMD4/RE4)*

### Notes on the sheet
- PCB design/layout notes & considerations
- Design notes
- Design Capabilities
- Cct
- Designed by
- Rev
- Date
- Sheet
- of
- Labels drawn without touching a wire or pin: Order the 10x10mm version
- (in symbol 32-Pin 0.1" Header) 32 Pin 0.1" Header
- (in symbol PIC24FJ256GA106 Microprocessor) Remappable Pin; Remappable Input Pin
- (in symbol Test Clip) Clip; Test

### Library data of the parts
BOB1 = 1k 1210 1%: 1/8W; Manufacturer: Chip Quik Inc.; Manufacturer Part Number: PA0096; Proto Board Type: SMD to DIP; Package Accepted: LQFP, TQFP, VQFP; Number of Positions: 64; Pitch: 0.020" (0.50mm); Board Thickness: 0.062" (1.57mm) 1/16"; Supplier 1: Digi-Key; Supplier Part Number 1: PA0096-ND; RoHS: RoHS Compliant; Category: Prototyping Products; Stock 1: 56; Pricing 1: 1=15.79 (USD); Part Status: Active; Hole Diameter: -; Material: FR4 Epoxy Glass; Size / Dimension: 1.000" x 3.200" (25.40mm x 81.28mm); ComponentLink1URL: http://www.chipquik.com/datasheets/PA0096.pdf; ComponentLink1Description: Spec Sheet
C4 = 10uF 0805 10V: Manufacturer: Kemet; Manufacturer Part Number: C0805C106K8PACTU; Tolerance: ±10%; Temperature Coefficient: X5R; Value: 10uF 0805 10V; Supplier 1: Digi-Key; RoHS: RoHS Compliant; Category: Capacitors; Stock 1: 215894; Pricing 1: 1=0.21, 10=0.14, 50=0.085, 100=0.0714, 250=0.0578, 500=0.051, 1000=0.04335 (USD); Packaging: Cut Tape (CT); Voltage - Rated: 10V; Mounting Type: Surface Mount, MLCC; Operating Temperature: -55°C ~ 85°C; Applications: General Purpose; Ratings: -; Package / Case: 0805 (2012 Metric); Size / Dimension: 0.079" L x 0.049" W (2.00mm x 1.25mm); Height - Seated (Max): -; Thickness (Max): 0.055" (1.40mm); Lead Spacing: -; Features: -; Lead Style: -; ComponentLink1URL: http://www.kemet.com/docfinder?Partnumber=C0805C106K8PACTU; ComponentLink1Description: Spec Sheet; Supplier Part Number 1: 399-4925-1-ND
C5-C8 = 100nF 0603 50V: as C15 on sheet Half H-Bridge Driver; Value: 100nF 0603 50V; Supplier 1: Digi-Key; RoHS: RoHS Compliant; Category: Capacitors; Stock 1: 1192070; Pricing 1: 1=0.1, 10=0.027, 25=0.0192, 100=0.0125, 500=0.00874, 1000=0.00681 (USD); Packaging: Cut Tape (CT); Voltage - Rated: 50V; Mounting Type: Surface Mount, MLCC; Operating Temperature: -55°C ~ 125°C; Applications: Boardflex Sensitive; Ratings: -; Package / Case: 0603 (1608 Metric); Size / Dimension: 0.063" L x 0.031" W (1.60mm x 0.80mm); Height - Seated (Max): -; Thickness (Max): 0.035" (0.90mm); Lead Spacing: -; Features: Soft Termination; Lead Style: -; ComponentLink1URL: http://www.samsungsem.com/kr/front/downloadcms.do?path=/kr/support/product-search/mlcc/__icsFiles/afieldfile/2014/11/05&fileName=S_CL10B104KB8SFNC.pdf; ComponentLink1Description: Spec Sheet; Supplier Part Number 1: 1276-1936-1-ND
J1 J2 = 32-Pin 0.1" Header: Manufacturer: Wurth Electronics Inc; Manufacturer Part Number: 61303211821; Style: Board to Board; Number of Positions: 32; Number of Positions Loaded: All; Pitch - Mating: 0.100" (2.54mm); Contact Length - Post: 0.122" (3.10mm); Material Flammability Rating: UL94 V-0; Current Rating: 3A; Voltage Rating: 250VAC; Supplier 1: Digi-Key; RoHS: RoHS Compliant; Category: Connectors, Interconnects; Stock 1: 332; Pricing 1: 1=1.86, 10=1.788, 50=1.65, 100=1.5125, 500=1.375 (USD); Packaging: Tray; Part Status: Active; Connector Type: Header; Contact Type: Forked; Number of Rows: 1; Row Spacing - Mating: -; Mounting Type: Through Hole; Termination: Solder; Fastening Type: Push-Pull; Contact Finish - Mating: Gold; Contact Finish Thickness - Mating: -; Insulation Color: Black; Insulation Height: 0.335" (8.51mm); Operating Temperature: -40°C ~ 105°C; Contact Finish - Post: Gold; Mated Stacking Heights: -; Ingress Protection: -; Features: -; Applications: -; Insulation Material: Polybutylene Terephthalate (PBT); Contact Shape: Square; Contact Material: Copper Alloy; Contact Finish Thickness - Post: -; ComponentLink1URL: http://katalog.we-online.de/em/datasheet/6130xx11821.pdf; ComponentLink1Description: Spec Sheet; Supplier Part Number 1: 732-2860-ND
R19 = 100R 0603 1%: 1/8W; Manufacturer: Yageo; Manufacturer Part Number: RC0603FR-07100RL; Power (Watts): 0.1W, 1/10W; Temperature Coefficient: ±100ppm/°C; Value: 100R 0603 1%; Supplier 1: Digi-Key; RoHS: RoHS Compliant; Category: Resistors; Stock 1: 2116183; Pricing 1: 1=0.1, 10=0.015, 25=0.0108, 100=0.006, 250=0.00456, 500=0.00364, 1000=0.00268, 2500=0.00233 (USD); Packaging: Cut Tape (CT); Tolerance: ±1%; Composition: Thick Film; Features: Moisture Resistant; Operating Temperature: -55°C ~ 155°C; Package / Case: 0603 (1608 Metric); Supplier Device Package: 0603; Size / Dimension: 0.063" L x 0.031" W (1.60mm x 0.80mm); Height: 0.022" (0.55mm); Number of Terminations: 2; ComponentLink1URL: http://www.yageo.com/NewPortal/yageodocoutput?fileName=/pdf/R-Chip/PYu-RC_Group_51_RoHS_L_0.pdf; ComponentLink1Description: http://www.yageo.com/NewPortal/yageodocoutput?fileName=/pdf/R-Chip/PYu-RC_Group_51_RoHS_L_0.pdf; Supplier Part Number 1: 311-100HRCT-ND
TP3 = Test Clip: Manufacturer: TE Connectivity AMP Connectors; Manufacturer Part Number: RCU-0C; Value: SMT Test Clip; Material - Insulation: No Insulation; Technology: SMT; Supplier 1: Digi-Key; RoHS: RoHS Compliant; Category: Test and Measurement; Stock 1: 58926; Pricing 1: 1=0.31, 10=0.291, 25=0.248, 50=0.217, 100=0.2014, 250=0.1782, 500=0.17046, 1000=0.13947 (CAD); Packaging: Cut Tape (CT); Part Status: Active; Type: PC Test Point; Mounting Type: Surface Mount; Color: Natural; Size / Dimension: 0.063" x 0.031" x 0.045" (1.60mm x 0.80mm x 1.15mm); Plating: -; Material - Body: -; ComponentLink1URL: http://www.te.com/commerce/DocumentDelivery/DDEController?Action=srchrtrv&DocNm=1773266&DocType=DS&DocLang=English; ComponentLink1Description: Spec Sheet; Supplier Part Number 1: A106145CT-ND
U1 = PIC24FJ256GA106 Microprocessor: General Purpose 16-Bit Flash Microcontroller, 256KB Flash, 16KB SRAM, 64-Pin TQFP, Industrial Temperature; Manufacturer: Microchip Technology; Manufacturer Part Number: PIC24FJ256GA106-I/PT; Core Processor: PIC; Speed: 32MHz; Connectivity: I²C, PMP, SPI, UART/USART; Peripherals: Brown-out Detect/Reset, LVD, POR, PWM, WDT; Number of I/O: 53; Program Memory Size: 256KB (85.5K x 24); RAM Size: 16K x 8; Voltage - Supply (Vcc/Vdd): 2 V ~ 3.6 V; Data Converters: A/D 16x10b; Oscillator Type: Internal; Value: PIC24FJ256GA106 Microprocessor; Technology: SMT; Supplier 1: Digi-Key; Supplier Part Number 1: PIC24FJ256GA106-I/PT-ND; RoHS: RoHS Compliant; Category: Integrated Circuits (ICs); Stock 1: 6379; Pricing 1: 1=7.45, 10=6.201, 25=5.6864, 100=5.1477 (CAD); Packaging: Tray; Core Size: 16-Bit; Program Memory Type: FLASH; EEPROM Size: -; Operating Temperature: -40°C ~ 85°C; Package / Case: 64-TQFP; Supplier Device Package: 64-TQFP (10x10); ComponentLink1URL: http://www.microchip.com/mymicrochip/filehandler.aspx?ddocname=en534317; ComponentLink1Description: Spec Sheet

## Sheet Vsense 0-69.3V.SchDoc: Vsense from 0 to 69.3V
size Letter; Date: 2017-02-08; DocumentNumber: 12; Revision: A; SheetNumber: 12; SheetTotal: 16; DesignedBy: Mike MacKay
Used 3 times, as channels Vsense 0-69.3V, Vsense (0-69.3V), Vsense 0-69.3V. Parts and nets are listed once, with the designators drawn on the sheet.
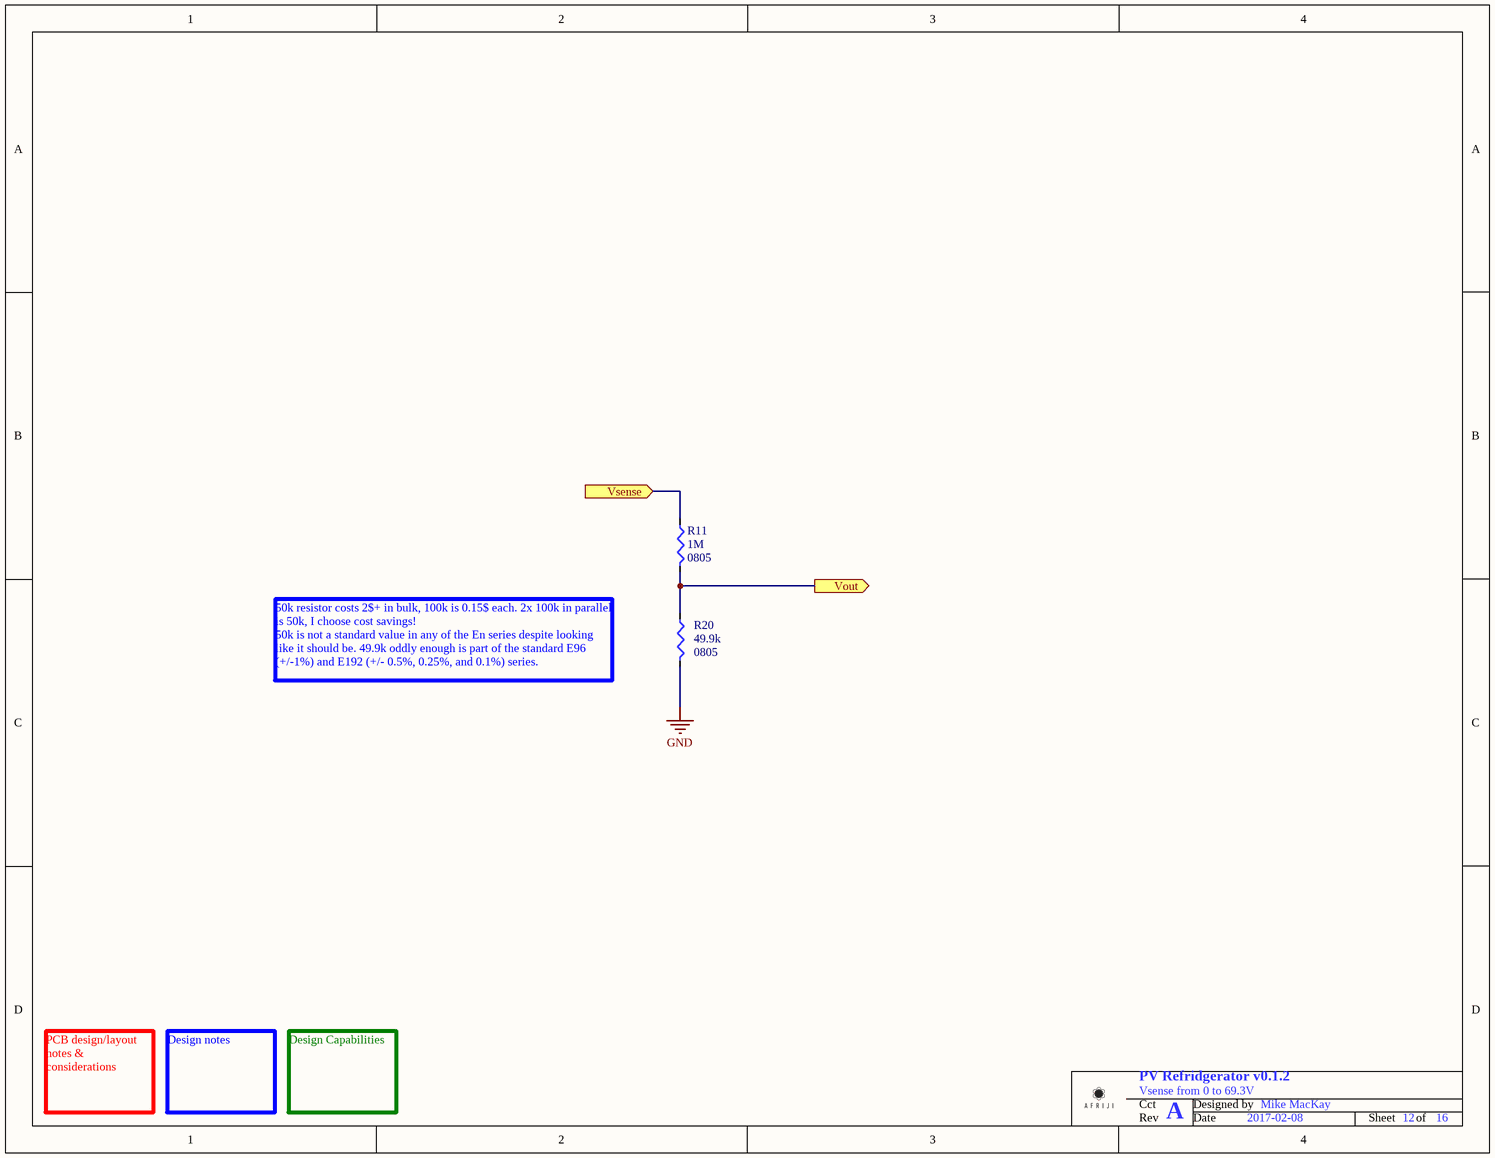
[diagram p6: Vsense 0-69.3V.SchDoc]

### Parts
R11  Resistance (Ohms): 1M  Package / Case: 0805  [R0805]  (hidden comment: Template - Resistor)
R20  Resistance (Ohms): 49.9k  Supplier Device Package: 0805  [R0805]  (hidden comment: Template - Resistor)

### Ports
Vout (out), Vsense (in)

### Nets
GND: R20.1
Vout: R11.1 R20.2 ; port Vout
Vsense: R11.2 ; port Vsense

### Channels
Vsense 0-69.3V: designators end in A; ports Vout=Vsense (+T1.P) Vsense=NetNetTie8_1
Vsense (0-69.3V): designators end in B; ports Vout=Vsense (+Vsolar) Vsense=NetNetTie7_1
Vsense 0-69.3V: designators end in C; ports Vout=Vsense (-T1.P) Vsense=NetNetTie9_1

### Notes on the sheet
- 50k resistor costs 2$+ in bulk, 100k is 0.15$ each. 2x 100k in parallel is 50k, I choose cost savings!
  50k is not a standard value in any of the En series despite looking like it should be. 49.9k oddly enough is part of the standard E96 (+/-1%) and E192 (+/- 0.5%, 0.25%, and 0.1%) series.
- PCB design/layout notes & considerations
- Design notes
- Design Capabilities
- Cct
- Designed by
- Rev
- Date
- Sheet
- of

### Library data of the parts
R11 = Template - Resistor: Resistor; Manufacturer: Yageo; Manufacturer Part Number: RC0805FR-071ML; Value: 1M 0805 1%; Tolerance: ±1%; Power (Watts): 0.125W, 1/8W; Temperature Coefficient: ±100ppm/°C; Technology: SMT; Supplier 1: Digi-Key; Supplier Part Number 1: 311-1.00MCRCT-ND; RoHS: RoHS Compliant; Category: Resistors; Stock 1: 1722700; Pricing 1: 1=0.1, 10=0.019, 25=0.0136, 50=0.0104, 100=0.0077, 250=0.00584, 500=0.00468, 1000=0.00345 (USD); Packaging: Cut Tape (CT); Part Status: Active; Composition: Thick Film; Features: Moisture Resistant; Operating Temperature: -55°C ~ 155°C; Supplier Device Package: 0805; Size / Dimension: 0.079" L x 0.049" W (2.00mm x 1.25mm); Height - Seated (Max): 0.024" (0.60mm); Number of Terminations: 2; Failure Rate: -; ComponentLink1URL: http://www.yageo.com/NewPortal/yageodocoutput?fileName=/pdf/R-Chip/PYu-RC_Group_51_RoHS_L_4.pdf; ComponentLink1Description: Spec Sheet
R20 = Template - Resistor: Manufacturer: Yageo; Manufacturer Part Number: RC0805FR-0749K9L; Value: 49.9k 0603 1%; Tolerance: ±1%; Power (Watts): 0.125W, 1/8W; Temperature Coefficient: ±100ppm/°C; Supplier 1: Digi-Key; Supplier Part Number 1: 311-49.9KCRCT-ND; RoHS: RoHS Compliant; Category: Resistors; Stock 1: 860512; Pricing 1: 1=0.1, 10=0.019, 25=0.0136, 50=0.0104, 100=0.0077, 250=0.00584, 500=0.00468, 1000=0.00345 (USD); Packaging: Cut Tape (CT); Part Status: Active; Composition: Thick Film; Features: Moisture Resistant; Operating Temperature: -55°C ~ 155°C; Package / Case: 0805 (2012 Metric); Size / Dimension: 0.079" L x 0.049" W (2.00mm x 1.25mm); Height - Seated (Max): 0.024" (0.60mm); Number of Terminations: 2; Failure Rate: -; ComponentLink1URL: http://www.yageo.com/NewPortal/yageodocoutput?fileName=/pdf/R-Chip/PYu-RC_Group_51_RoHS_L_4.pdf; ComponentLink1Description: http://www.yageo.com/NewPortal/yageodocoutput?fileName=/pdf/R-Chip/PYu-RC_Group_51_RoHS_L_4.pdf

## Sheet Vsense 0-223.3V.SchDoc: Vsense from 0 to 223.3V
size Letter; Date: 2017-02-08; DocumentNumber: 13; Revision: A; SheetNumber: 13; SheetTotal: 16; DesignedBy: Mike MacKay
Used 4 times, as channels Vsense 0-223, Vsense 0-223, Vsense 0-223, Vsense 0-223. Parts and nets are listed once, with the designators drawn on the sheet.
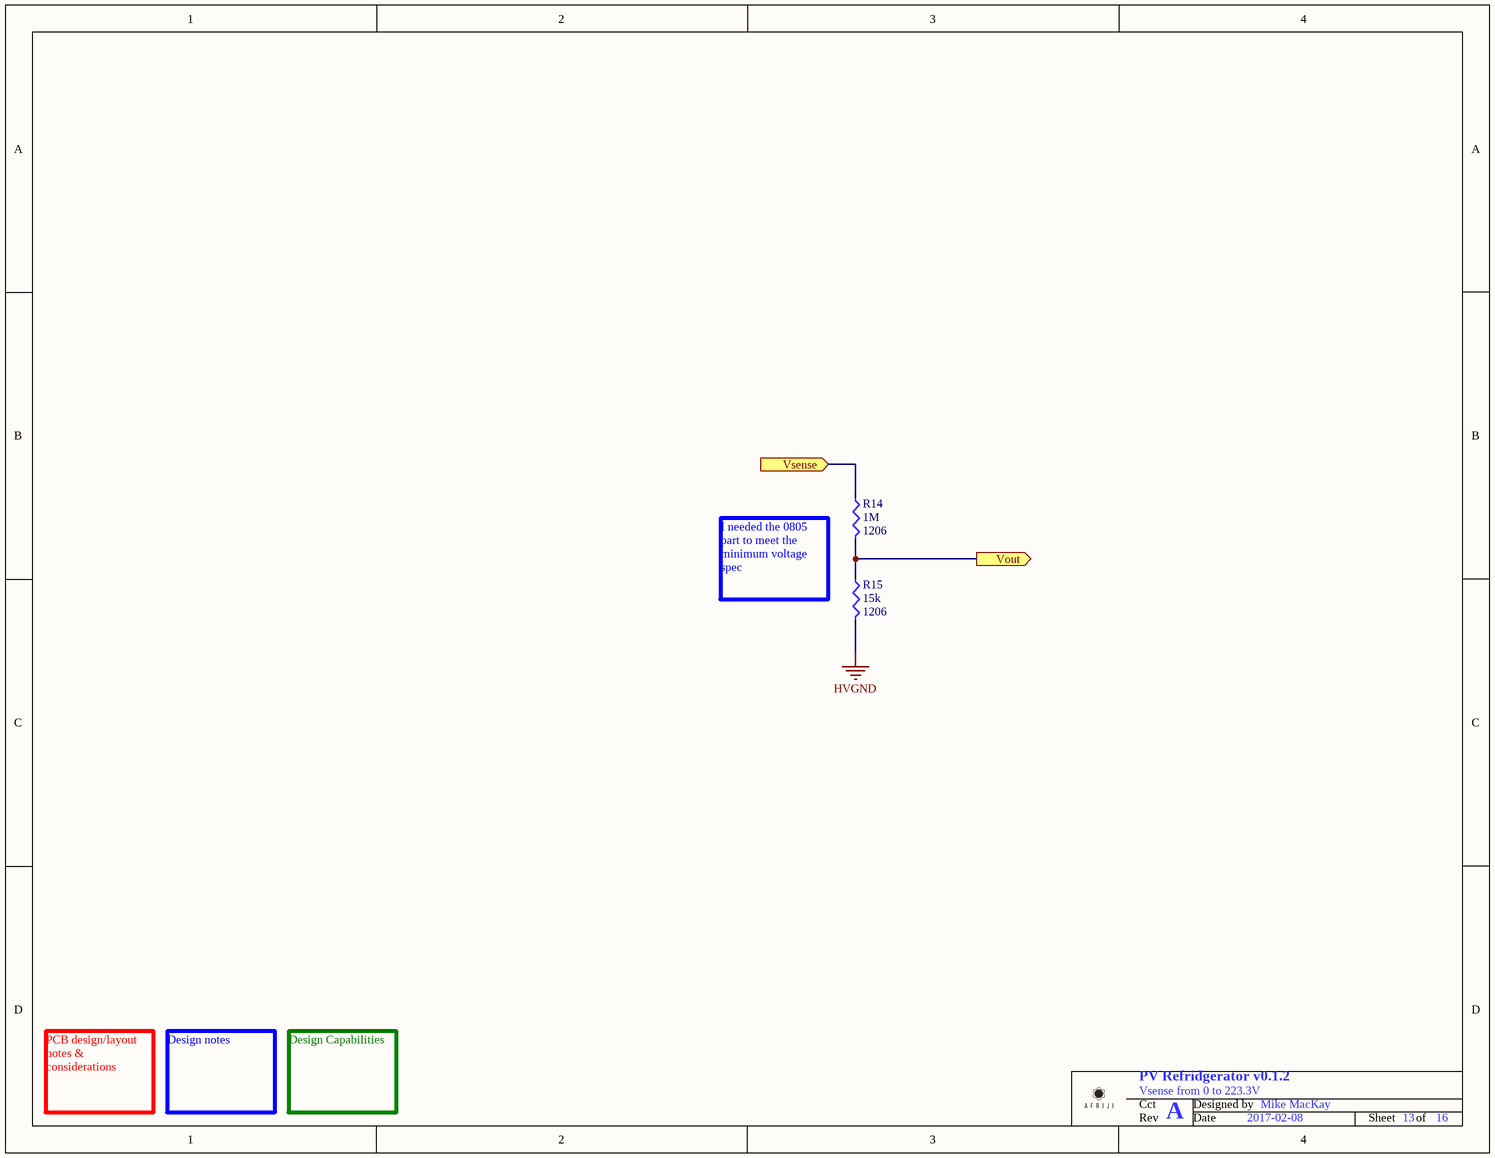
[diagram p7: Vsense 0-223.3V.SchDoc]

### Parts
R14  Resistance (Ohms): 1M  Supplier Device Package: 1206  [R1210]  (hidden comment: Template - Resistor)
R15  Resistance (Ohms): 15k  Supplier Device Package: 1206  [R1210]  (hidden comment: Template - Resistor)

### Ports
Vout (out), Vsense (in)

### Nets
HVGND: R15.1
Vout: R14.1 R15.2 ; port Vout
Vsense: R14.2 ; port Vsense

### Channels
Vsense 0-223: designators end in A; ports Vout=Vsense (+T1 S) Vsense=+VT1.S
Vsense 0-223: designators end in B; ports Vout=Vsense (+Vdc Bus) Vsense=+DC Bus
Vsense 0-223: designators end in C; ports Vout=Vsense (+Vout) Vsense=C_VS
Vsense 0-223: designators end in D; ports Vout=Vsense (-Vout) Vsense=D_VS

### Notes on the sheet
- I needed the 0805 part to meet the minimum voltage spec
- PCB design/layout notes & considerations
- Design notes
- Design Capabilities
- Cct
- Designed by
- Rev
- Date
- Sheet
- of

### Library data of the parts
R14 = Template - Resistor: Resistor; Manufacturer: Yageo; Manufacturer Part Number: RV1206FR-071ML; Value: 1M 1206 1%; Description: RES SMD 1M OHM 1% 1/4W 1206; Tolerance: ±1%; Power (Watts): 0.25W, 1/4W; Temperature Coefficient: ±200ppm/°C; Supplier 1: Digi-Key; Supplier Part Number 1: 311-1MNICT-ND; RoHS: RoHS Compliant; Category: Resistors; Stock 1: 79790; Pricing 1: 1=0.34, 10=0.289, 25=0.2104, 50=0.1526, 100=0.1131, 250=0.0868, 500=0.06838, 1000=0.04734 (USD); Packaging: Cut Tape (CT); Part Status: Active; Composition: Thick Film; Features: High Voltage, Moisture Resistant; Operating Temperature: -55°C ~ 155°C; Package / Case: 1206 (3216 Metric); Size / Dimension: 0.122" L x 0.063" W (3.10mm x 1.60mm); Height - Seated (Max): 0.026" (0.65mm); Number of Terminations: 2; Failure Rate: -; ComponentLink1URL: http://www.yageo.com/documents/recent/PYu-RV_51_RoHS_L_6.pdf; ComponentLink1Description: http://www.yageo.com/documents/recent/PYu-RV_51_RoHS_L_6.pdf
R15 = Template - Resistor: Manufacturer: Yageo; Manufacturer Part Number: RC1206FR-0715KL; Value: 15k 1206 1%; Description: RES SMD 15K OHM 1% 1/4W 1206; Tolerance: ±1%; Power (Watts): 0.25W, 1/4W; Temperature Coefficient: ±100ppm/°C; Supplier 1: Digi-Key; Supplier Part Number 1: 311-15.0KFRCT-ND; RoHS: RoHS Compliant; Category: Resistors; Stock 1: 143517; Pricing 1: 1=0.1, 10=0.029, 25=0.0212, 50=0.016, 100=0.0118, 250=0.009, 500=0.0072, 1000=0.0053 (USD); Packaging: Cut Tape (CT); Part Status: Active; Composition: Thick Film; Features: Moisture Resistant; Operating Temperature: -55°C ~ 155°C; Package / Case: 1206 (3216 Metric); Size / Dimension: 0.122" L x 0.063" W (3.10mm x 1.60mm); Height - Seated (Max): 0.026" (0.65mm); Number of Terminations: 2; Failure Rate: -; ComponentLink1URL: http://www.yageo.com/NewPortal/yageodocoutput?fileName=/pdf/R-Chip/PYu-RC_Group_51_RoHS_L_4.pdf; ComponentLink1Description: http://www.yageo.com/NewPortal/yageodocoutput?fileName=/pdf/R-Chip/PYu-RC_Group_51_RoHS_L_4.pdf